# Altium project pokey.PrjPcb
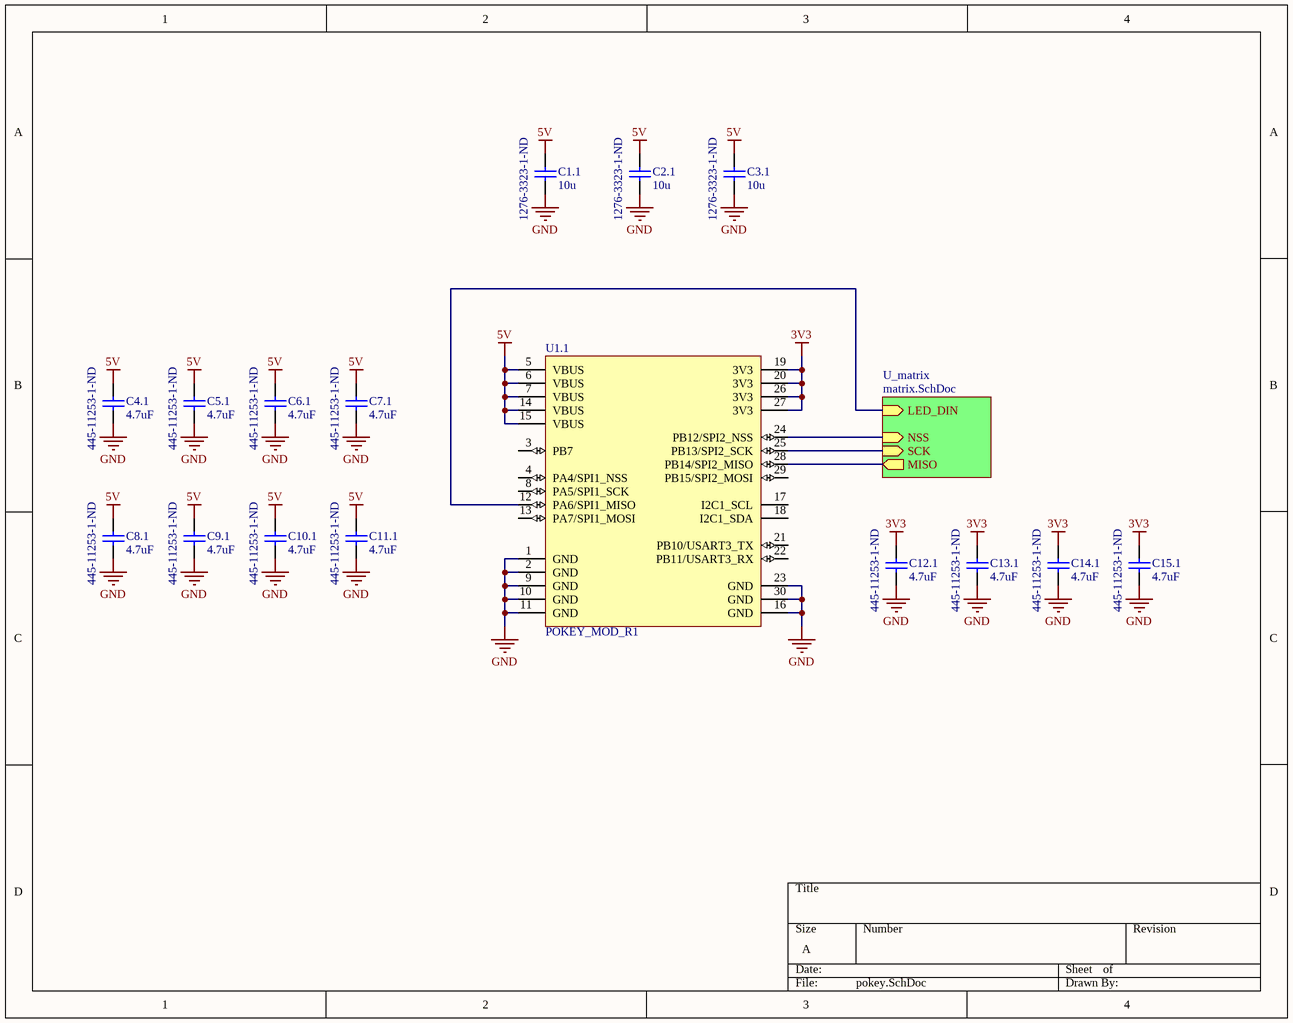
[diagram p0: pokey.SchDoc]
Assembly_Version: 01; PCB_Version: 1.0
3 sheets, 385 parts. Net scope: hierarchical (ports join the sheet entries above them; power ports are global).
Board file: pokey.PcbDoc
Sheets:
  pokey.SchDoc
    U_matrix = matrix.SchDoc
      U1 = key.SchDoc
      U1 = key.SchDoc
      U1 = key.SchDoc
      U1 = key.SchDoc
      U1 = key.SchDoc
      U1 = key.SchDoc
      U1 = key.SchDoc
      U1 = key.SchDoc
      U1 = key.SchDoc
      U1 = key.SchDoc
      U1 = key.SchDoc
      U1 = key.SchDoc
      U1 = key.SchDoc
      U1 = key.SchDoc
      U1 = key.SchDoc
      U1 = key.SchDoc
      U1 = key.SchDoc
      U1 = key.SchDoc
      U1 = key.SchDoc
      U1 = key.SchDoc
      U1 = key.SchDoc
      U1 = key.SchDoc
      U1 = key.SchDoc
      U1 = key.SchDoc
      U1 = key.SchDoc
      U1 = key.SchDoc
      U1 = key.SchDoc
      U1 = key.SchDoc
      U1 = key.SchDoc
      U1 = key.SchDoc
      U1 = key.SchDoc
      U1 = key.SchDoc
      U1 = key.SchDoc
      U1 = key.SchDoc
      U1 = key.SchDoc
      U1 = key.SchDoc
      U1 = key.SchDoc
      U1 = key.SchDoc
      U1 = key.SchDoc
      U1 = key.SchDoc
      U1 = key.SchDoc
      U1 = key.SchDoc
      U1 = key.SchDoc
      U1 = key.SchDoc
      U1 = key.SchDoc
      U1 = key.SchDoc
      U1 = key.SchDoc
      U1 = key.SchDoc
      U1 = key.SchDoc
      U1 = key.SchDoc
      U1 = key.SchDoc
      U1 = key.SchDoc
      U1 = key.SchDoc
      U1 = key.SchDoc
      U1 = key.SchDoc
      U1 = key.SchDoc
      U1 = key.SchDoc
      U1 = key.SchDoc
      U1 = key.SchDoc
      U1 = key.SchDoc
      U1 = key.SchDoc
      U1 = key.SchDoc
      U1 = key.SchDoc
      U1 = key.SchDoc
      U1 = key.SchDoc
      U1 = key.SchDoc
      U1 = key.SchDoc
      U1 = key.SchDoc
      U1 = key.SchDoc
      U1 = key.SchDoc
      U1 = key.SchDoc
      U1 = key.SchDoc
      U1 = key.SchDoc
      U1 = key.SchDoc
      U1 = key.SchDoc
      U1 = key.SchDoc
      U1 = key.SchDoc
      U1 = key.SchDoc
      U1 = key.SchDoc
      U1 = key.SchDoc
      U1 = key.SchDoc
      U1 = key.SchDoc
      U1 = key.SchDoc
      U1 = key.SchDoc
      U1 = key.SchDoc

## Sheet pokey.SchDoc
size A

### Parts
C1.1  Supplier Part Number 1: 1276-3323-1-ND  [1210]  (hidden comment: 10u)
C2.1  Supplier Part Number 1: 1276-3323-1-ND  [1210]  (hidden comment: 10u)
C3.1  Supplier Part Number 1: 1276-3323-1-ND  [1210]  (hidden comment: 10u)
C4.1  4.7uF  Supplier Part Number 1: 445-11253-1-ND  [1608[0603]]
C5.1  4.7uF  Supplier Part Number 1: 445-11253-1-ND  [1608[0603]]
C6.1  4.7uF  Supplier Part Number 1: 445-11253-1-ND  [1608[0603]]
C7.1  4.7uF  Supplier Part Number 1: 445-11253-1-ND  [1608[0603]]
C8.1  4.7uF  Supplier Part Number 1: 445-11253-1-ND  [1608[0603]]
C9.1  4.7uF  Supplier Part Number 1: 445-11253-1-ND  [1608[0603]]
C10.1  4.7uF  Supplier Part Number 1: 445-11253-1-ND  [1608[0603]]
C11.1  4.7uF  Supplier Part Number 1: 445-11253-1-ND  [1608[0603]]
C12.1  4.7uF  Supplier Part Number 1: 445-11253-1-ND  [1608[0603]]
C13.1  4.7uF  Supplier Part Number 1: 445-11253-1-ND  [1608[0603]]
C14.1  4.7uF  Supplier Part Number 1: 445-11253-1-ND  [1608[0603]]
C15.1  4.7uF  Supplier Part Number 1: 445-11253-1-ND  [1608[0603]]
U1.1  POKEY_MOD_R1  [POKEY_MOD_R1]

### Sub-sheets
U_matrix = matrix.SchDoc: LED_DIN (in), SCK (in), MISO (out), NSS (in)

### Nets
3V3: C12.1.2 C13.1.2 C14.1.2 C15.1.2 U1.1.19(3V3) U1.1.20(3V3) U1.1.26(3V3) U1.1.27(3V3)
5V: C1.1.2 C2.1.2 C3.1.2 C4.1.2 C5.1.2 C6.1.2 C7.1.2 C8.1.2 C9.1.2 C10.1.2 C11.1.2 U1.1.5(VBUS) U1.1.6(VBUS) U1.1.7(VBUS) U1.1.14(VBUS) U1.1.15(VBUS)
GND: C1.1.1 C2.1.1 C3.1.1 C4.1.1 C5.1.1 C6.1.1 C7.1.1 C8.1.1 C9.1.1 C10.1.1 C11.1.1 C12.1.1 C13.1.1 C14.1.1 C15.1.1 U1.1.1(GND) U1.1.2(GND) U1.1.9(GND) U1.1.10(GND) U1.1.11(GND) U1.1.16(GND) U1.1.23(GND) U1.1.30(GND)
NetQ1.2_3: U1.1.12(PA6/SPI1_MISO) ; sheet U_matrix/LED_DIN
NetU1.1_24: U1.1.24(PB12/SPI2_NSS) ; sheet U_matrix/NSS
NetU1.1_25: U1.1.25(PB13/SPI2_SCK) ; sheet U_matrix/SCK
NetU1.1_28: U1.1.28(PB14/SPI2_MISO) ; sheet U_matrix/MISO

Not connected (* = marked no-connect by the designer): U1.1 3(PB7) 4(PA4/SPI1_NSS) 8(PA5/SPI1_SCK) 13(PA7/SPI1_MOSI) 17(I2C1_SCL) 18(I2C1_SDA) 21(PB10/USART3_TX) 22(PB11/USART3_RX) 29(PB15/SPI2_MOSI)

### Library data of the parts
C1.1 C2.1 C3.1 = CAPACITOR NON_POL: Material: Ceramic; Capacitance: 10uF; Tolerance: 10%; Dielectric: X7R; Voltage Rating: 35V; Value: 10u; ComponentLink1URL: http://www.murata.com/~/media/webrenewal/support/library/catalog/products/capacitor/mlcc/c02e.ashx; ComponentLink1Description: http://www.murata.com/~/media/webrenewal/support/library/catalog/products/capacitor/mlcc/c02e.ashx; Supplier 1: Digi-Key; Stock 1: 421732; Pricing 1: 1 = 0.81000, 10 = 0.57000, 100 = 0.37510, 500 = 0.27788, 1000 = 0.23619 (USD); RoHS: Yes; Mount: Surface Mount; Case/Package: 1210; Case Code (Metric): 3225; Case Code (Imperial): 1210; Min Operating Temperature: -55°C; Max Operating Temperature: 125°C; Package Quantity: 1; Packaging: Tape and Reel; Voltage: 35V; Length: 3.2mm; Height: 1.8mm; Depth: 2.5mm; Width: 0.098inch; Thickness: 0.079inch; Radiation Hardening: No; Lead Free: Lead Free; ComponentLink2URL: https://datasheet.ciiva.com/25724/cl32b106klulnne-25724000.pdf?src-supplier=Digi-Key; ComponentLink2Description: https://datasheet.ciiva.com/25724/cl32b106klulnne-25724000.pdf?src-supplier=Digi-Key; ComponentLink3URL: https://datasheet.ciiva.com/15196/getdatasheetpartid-353216-15196149.pdf?src-supplier=Verical; ComponentLink3Description: https://datasheet.ciiva.com/15196/getdatasheetpartid-353216-15196149.pdf?src-supplier=Verical; ComponentLink4URL: https://datasheet.ciiva.com/29202/450840-da-01-en-vs-kondensator-1210-29202828.pdf?src-supplier=Conrad; ComponentLink4Description: https://datasheet.ciiva.com/29202/450840-da-01-en-vs-kondensator-1210-29202828.pdf?src-supplier=Conrad
C4.1 C5.1 C6.1 C7.1 C8.1 C9.1 C10.1 C11.1 C12.1 C13.1 C14.1 C15.1 = C0402: Value: 4.7uF; Supplier 1: Digi-Key

## Sheet matrix.SchDoc
size 1270 x 241 mm
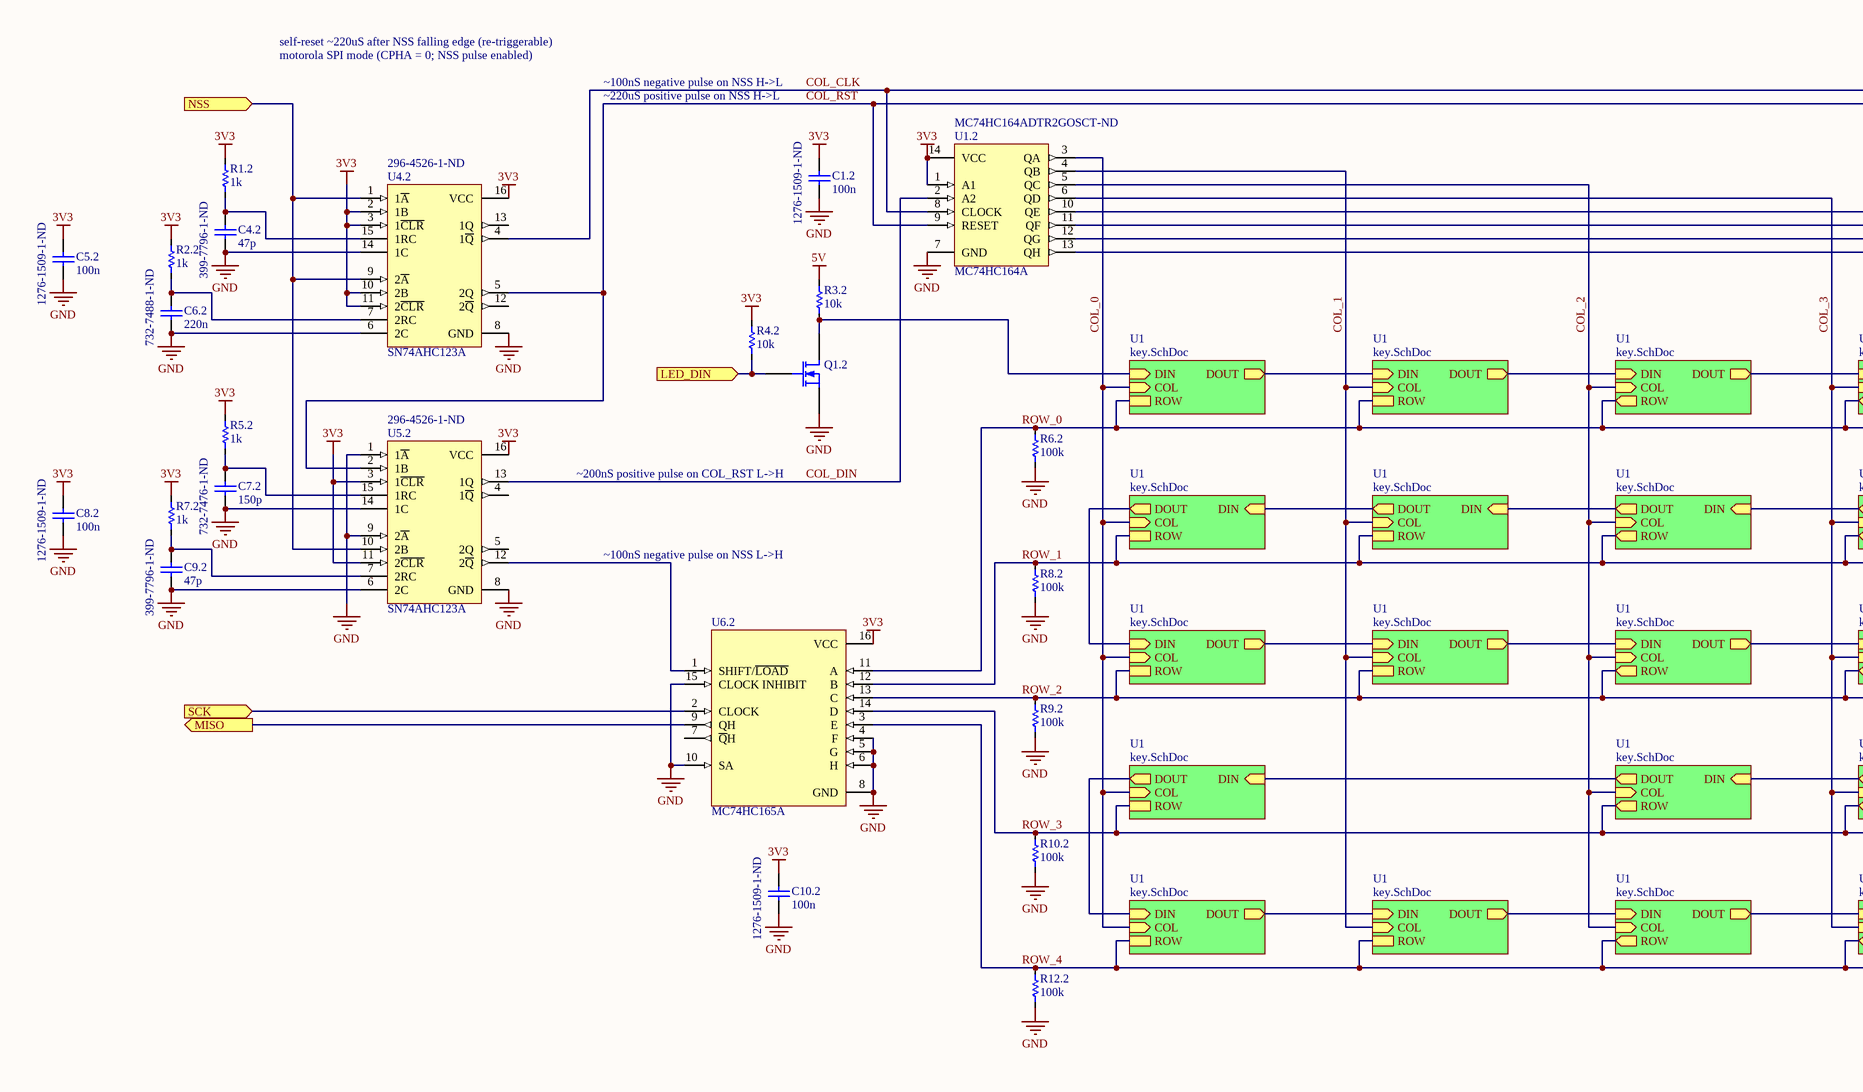
[diagram p1: matrix.SchDoc, left]
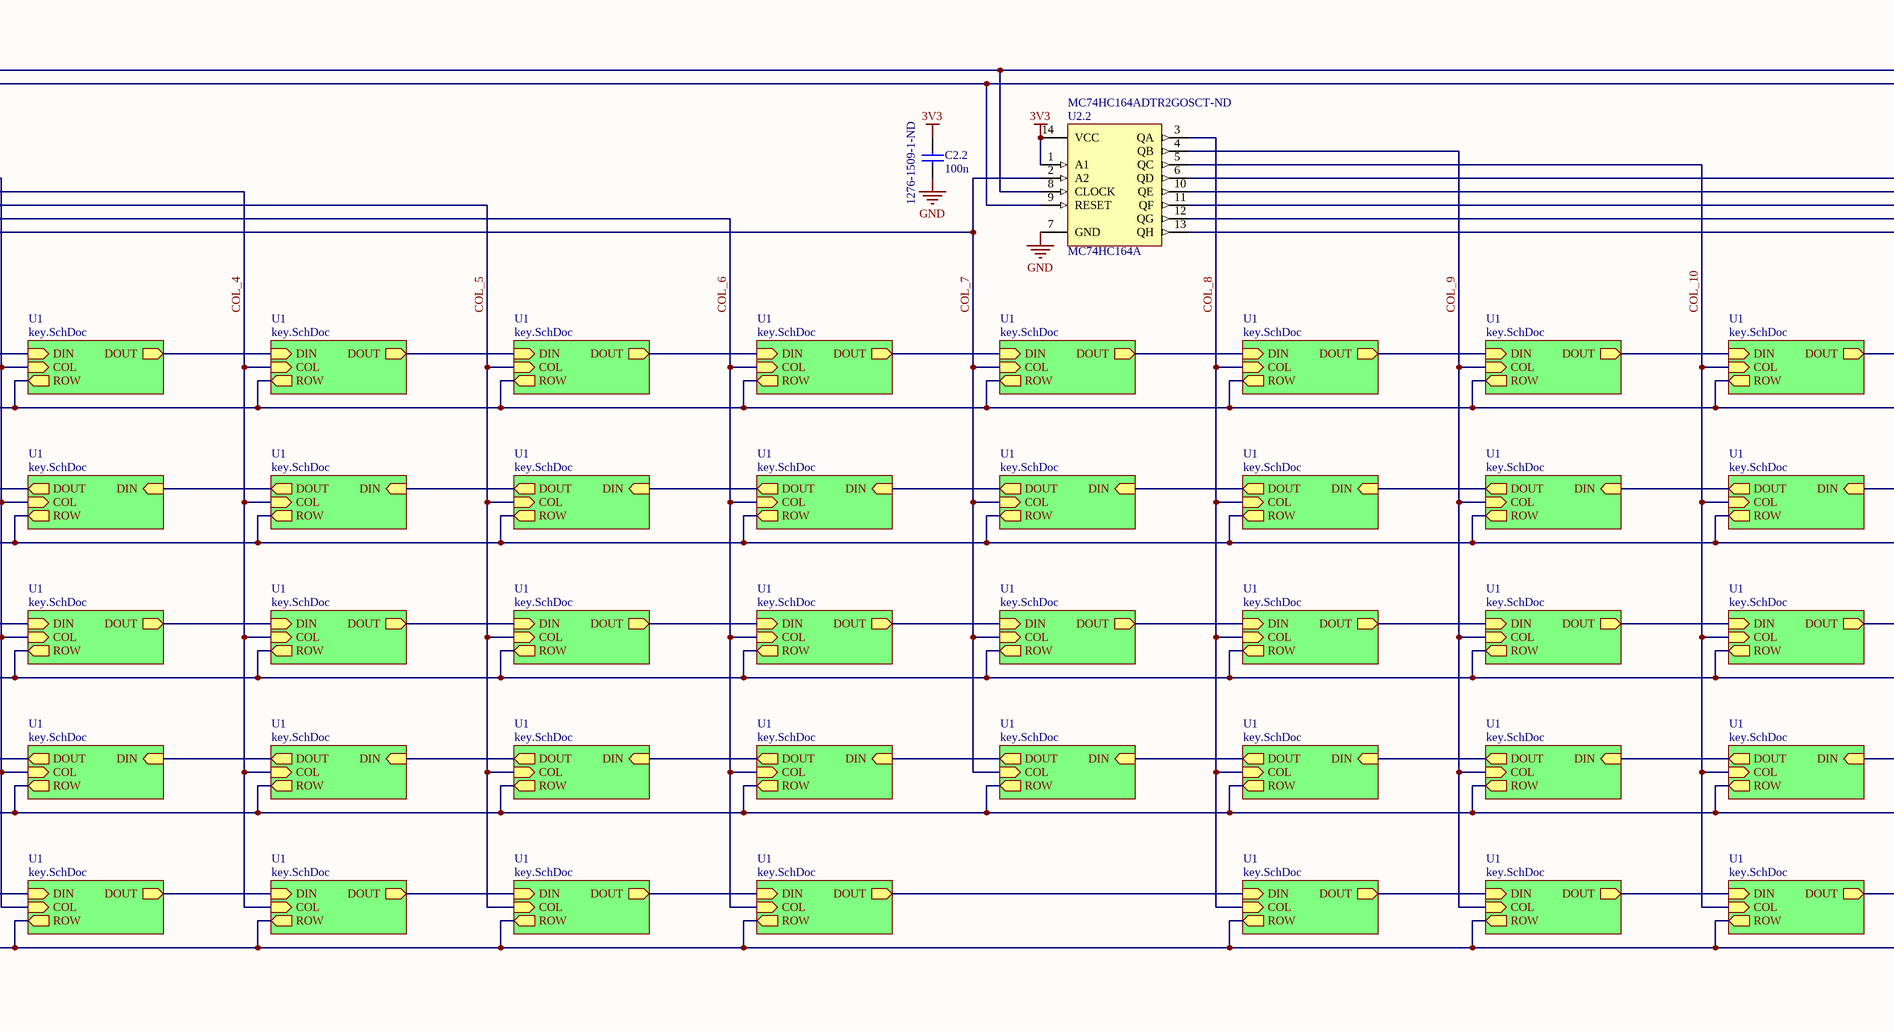
[diagram p2: matrix.SchDoc, middle]
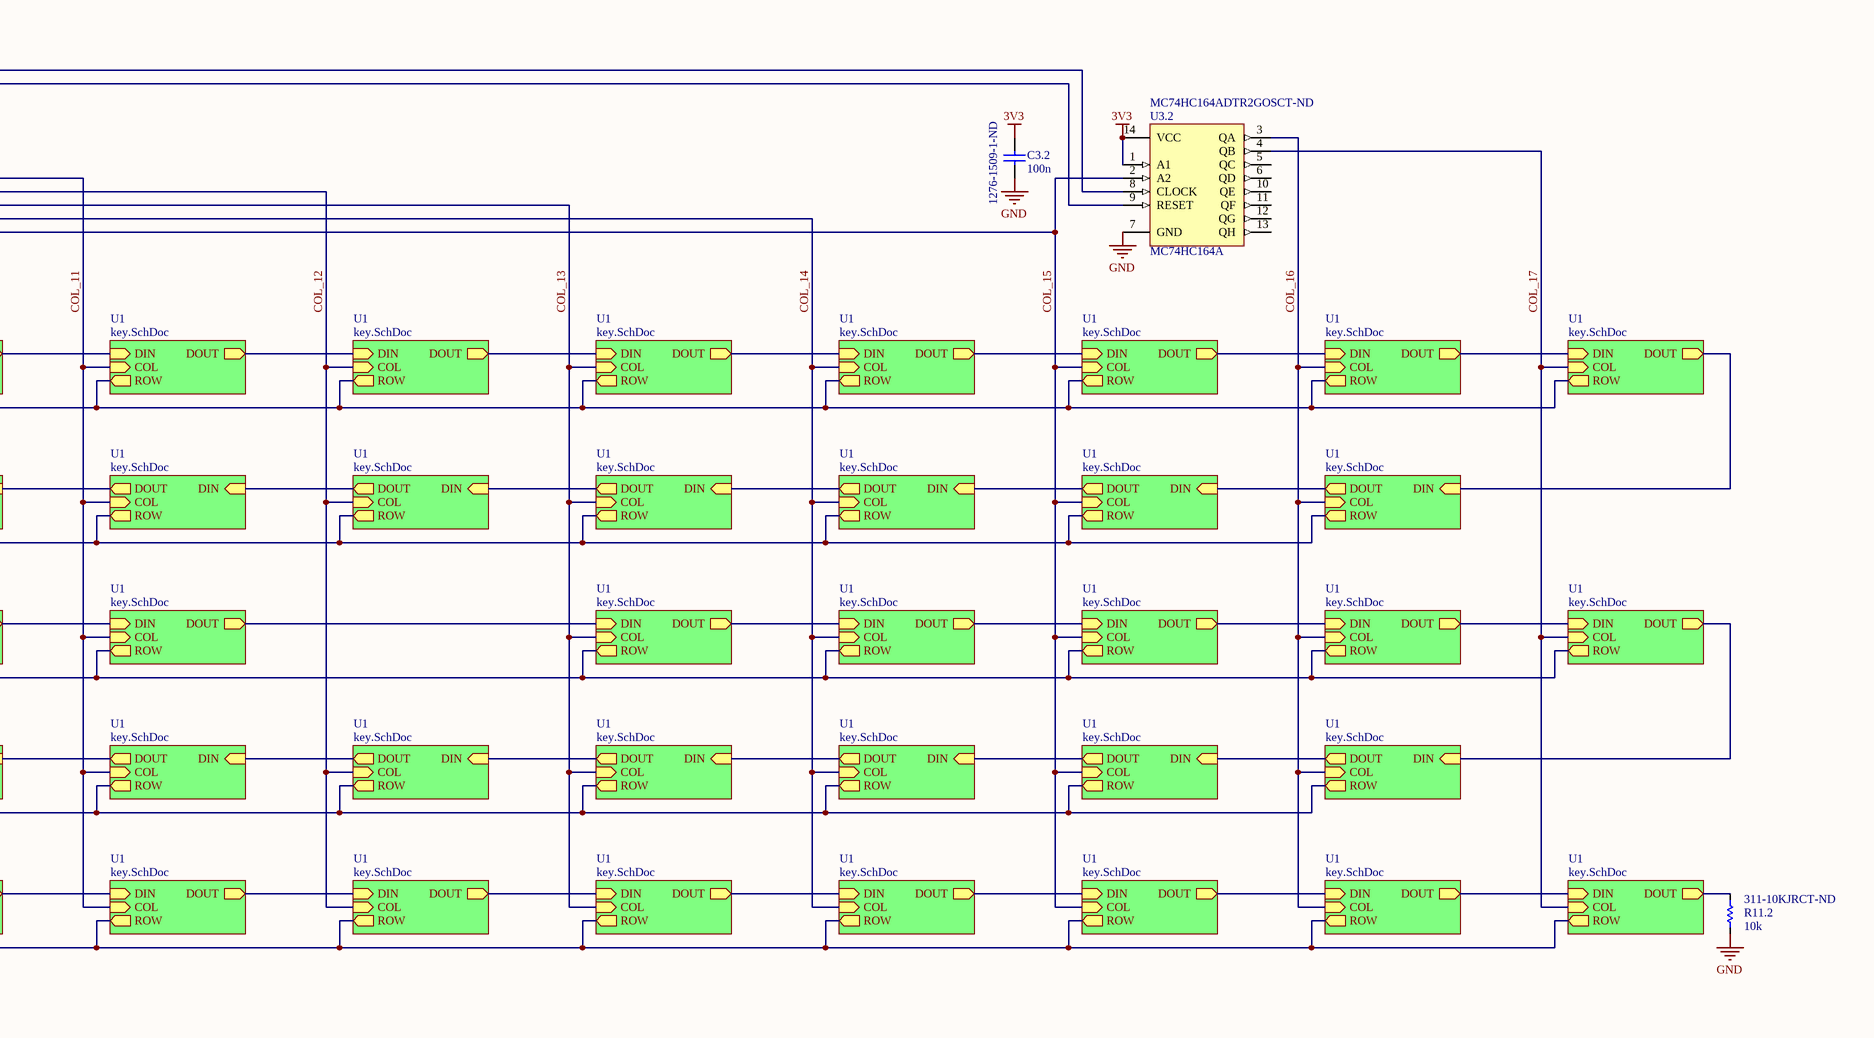
[diagram p3: matrix.SchDoc, right]

### Parts
C1.2  Supplier Part Number 1: 1276-1509-1-ND  [0402]  (hidden comment: 100n)
C2.2  Supplier Part Number 1: 1276-1509-1-ND  [0402]  (hidden comment: 100n)
C3.2  Supplier Part Number 1: 1276-1509-1-ND  [0402]  (hidden comment: 100n)
C4.2  Supplier Part Number 1: 399-7796-1-ND  [0402]  (hidden comment: 47p)
C5.2  Supplier Part Number 1: 1276-1509-1-ND  [0402]  (hidden comment: 100n)
C6.2  Supplier Part Number 1: 732-7488-1-ND  [0402]  (hidden comment: 220n)
C7.2  Supplier Part Number 1: 732-7476-1-ND  [0402]  (hidden comment: 150p)
C8.2  Supplier Part Number 1: 1276-1509-1-ND  [0402]  (hidden comment: 100n)
C9.2  Supplier Part Number 1: 399-7796-1-ND  [0402]  (hidden comment: 47p)
C10.2  Supplier Part Number 1: 1276-1509-1-ND  [0402]  (hidden comment: 100n)
Q1.2  2N7002  [SOT23]  (value not drawn)
R1.2  1k  [0402]
R2.2  1k  [0402]
R3.2  10k  [0402]
R4.2  10k  [0402]
R5.2  1k  [0402]
R6.2  100k  [0402]
R7.2  1k  [0402]
R8.2  100k  [0402]
R9.2  100k  [0402]
R10.2  100k  [0402]
R11.2  Supplier Part Number 1: 311-10KJRCT-ND  [0402]  (hidden comment: 10k)
R12.2  100k  [0402]
U1.2  MC74HC164A  Supplier Part Number 1: MC74HC164ADTR2GOSCT-ND  [TSOP65P640X120-14N]
U2.2  MC74HC164A  Supplier Part Number 1: MC74HC164ADTR2GOSCT-ND  [TSOP65P640X120-14N]
U3.2  MC74HC164A  Supplier Part Number 1: MC74HC164ADTR2GOSCT-ND  [TSOP65P640X120-14N]
U4.2  SN74AHC123A  Supplier Part Number 1: 296-4526-1-ND  [TSSOP16_N]
U5.2  SN74AHC123A  Supplier Part Number 1: 296-4526-1-ND  [TSSOP16_N]
U6.2  MC74HC165A  [TSSOP16_N]

### Sub-sheets
U1 = key.SchDoc: COL (in), ROW, DOUT (out), DIN (in)
U1 = key.SchDoc: COL (in), ROW, DOUT (out), DIN (in)
U1 = key.SchDoc: COL (in), ROW (out), DOUT (out), DIN (in)
U1 = key.SchDoc: COL (in), ROW (out), DOUT (out), DIN (in)
U1 = key.SchDoc: COL (in), ROW (out), DOUT (out), DIN (in)
U1 = key.SchDoc: COL (in), ROW (out), DOUT (out), DIN (in)
U1 = key.SchDoc: COL (in), ROW (out), DOUT (out), DIN (in)
U1 = key.SchDoc: COL (in), ROW (out), DOUT (out), DIN (in)
U1 = key.SchDoc: COL (in), ROW (out), DOUT (out), DIN (in)
U1 = key.SchDoc: COL (in), ROW (out), DOUT (out), DIN (in)
U1 = key.SchDoc: COL (in), ROW (out), DOUT (out), DIN (in)
U1 = key.SchDoc: COL (in), ROW (out), DOUT (out), DIN (in)
U1 = key.SchDoc: COL (in), ROW (out), DOUT (out), DIN (in)
U1 = key.SchDoc: COL (in), ROW (out), DOUT (out), DIN (in)
U1 = key.SchDoc: COL (in), ROW (out), DOUT (out), DIN (in)
U1 = key.SchDoc: COL (in), ROW (out), DOUT (out), DIN (in)
U1 = key.SchDoc: COL (in), ROW (out), DOUT (out), DIN (in)
U1 = key.SchDoc: COL (in), ROW (out), DOUT (out), DIN (in)
U1 = key.SchDoc: COL (in), ROW, DOUT (out), DIN (in)
U1 = key.SchDoc: COL (in), ROW, DOUT (out), DIN (in)
U1 = key.SchDoc: COL (in), ROW (out), DOUT (out), DIN (in)
U1 = key.SchDoc: COL (in), ROW (out), DOUT (out), DIN (in)
U1 = key.SchDoc: COL (in), ROW (out), DOUT (out), DIN (in)
U1 = key.SchDoc: COL (in), ROW (out), DOUT (out), DIN (in)
U1 = key.SchDoc: COL (in), ROW (out), DOUT (out), DIN (in)
U1 = key.SchDoc: COL (in), ROW (out), DOUT (out), DIN (in)
U1 = key.SchDoc: COL (in), ROW (out), DOUT (out), DIN (in)
U1 = key.SchDoc: COL (in), ROW (out), DOUT (out), DIN (in)
U1 = key.SchDoc: COL (in), ROW (out), DOUT (out), DIN (in)
U1 = key.SchDoc: COL (in), ROW (out), DOUT (out), DIN (in)
U1 = key.SchDoc: COL (in), ROW (out), DOUT (out), DIN (in)
U1 = key.SchDoc: COL (in), ROW (out), DOUT (out), DIN (in)
U1 = key.SchDoc: COL (in), ROW, DOUT (out), DIN (in)
U1 = key.SchDoc: COL (in), ROW, DOUT (out), DIN (in)
U1 = key.SchDoc: COL (in), ROW (out), DOUT (out), DIN (in)
U1 = key.SchDoc: COL (in), ROW (out), DOUT (out), DIN (in)
U1 = key.SchDoc: COL (in), ROW (out), DOUT (out), DIN (in)
U1 = key.SchDoc: COL (in), ROW (out), DOUT (out), DIN (in)
U1 = key.SchDoc: COL (in), ROW (out), DOUT (out), DIN (in)
U1 = key.SchDoc: COL (in), ROW (out), DOUT (out), DIN (in)
U1 = key.SchDoc: COL (in), ROW (out), DOUT (out), DIN (in)
U1 = key.SchDoc: COL (in), ROW (out), DOUT (out), DIN (in)
U1 = key.SchDoc: COL (in), ROW (out), DOUT (out), DIN (in)
U1 = key.SchDoc: COL (in), ROW (out), DOUT (out), DIN (in)
U1 = key.SchDoc: COL (in), ROW (out), DOUT (out), DIN (in)
U1 = key.SchDoc: COL (in), ROW, DOUT (out), DIN (in)
U1 = key.SchDoc: COL (in), ROW (out), DOUT (out), DIN (in)
U1 = key.SchDoc: COL (in), ROW (out), DOUT (out), DIN (in)
U1 = key.SchDoc: COL (in), ROW (out), DOUT (out), DIN (in)
U1 = key.SchDoc: COL (in), ROW (out), DOUT (out), DIN (in)
U1 = key.SchDoc: COL (in), ROW (out), DOUT (out), DIN (in)
U1 = key.SchDoc: COL (in), ROW (out), DOUT (out), DIN (in)
U1 = key.SchDoc: COL (in), ROW (out), DOUT (out), DIN (in)
U1 = key.SchDoc: COL (in), ROW (out), DOUT (out), DIN (in)
U1 = key.SchDoc: COL (in), ROW (out), DOUT (out), DIN (in)
U1 = key.SchDoc: COL (in), ROW (out), DOUT (out), DIN (in)
U1 = key.SchDoc: COL (in), ROW (out), DOUT (out), DIN (in)
U1 = key.SchDoc: COL (in), ROW, DOUT (out), DIN (in)
U1 = key.SchDoc: COL (in), ROW, DOUT (out), DIN (in)
U1 = key.SchDoc: COL (in), ROW (out), DOUT (out), DIN (in)
U1 = key.SchDoc: COL (in), ROW (out), DOUT (out), DIN (in)
U1 = key.SchDoc: COL (in), ROW (out), DOUT (out), DIN (in)
U1 = key.SchDoc: COL (in), ROW (out), DOUT (out), DIN (in)
U1 = key.SchDoc: COL (in), ROW (out), DOUT (out), DIN (in)
U1 = key.SchDoc: COL (in), ROW (out), DOUT (out), DIN (in)
U1 = key.SchDoc: COL (in), ROW (out), DOUT (out), DIN (in)
U1 = key.SchDoc: COL (in), ROW (out), DOUT (out), DIN (in)
U1 = key.SchDoc: COL (in), ROW (out), DOUT (out), DIN (in)
U1 = key.SchDoc: COL (in), ROW (out), DOUT (out), DIN (in)
U1 = key.SchDoc: COL (in), ROW (out), DOUT (out), DIN (in)
U1 = key.SchDoc: COL (in), ROW (out), DOUT (out), DIN (in)
U1 = key.SchDoc: COL (in), ROW (out), DOUT (out), DIN (in)
U1 = key.SchDoc: COL (in), ROW (out), DOUT (out), DIN (in)
U1 = key.SchDoc: COL (in), ROW (out), DOUT (out), DIN (in)
U1 = key.SchDoc: COL (in), ROW (out), DOUT (out), DIN (in)
U1 = key.SchDoc: COL (in), ROW (out), DOUT (out), DIN (in)
U1 = key.SchDoc: COL (in), ROW (out), DOUT (out), DIN (in)
U1 = key.SchDoc: COL (in), ROW (out), DOUT (out), DIN (in)
U1 = key.SchDoc: COL (in), ROW (out), DOUT (out), DIN (in)
U1 = key.SchDoc: COL (in), ROW (out), DOUT (out), DIN (in)
U1 = key.SchDoc: COL (in), ROW (out), DOUT (out), DIN (in)
U1 = key.SchDoc: COL (in), ROW (out), DOUT (out), DIN (in)
U1 = key.SchDoc: COL (in), ROW (out), DOUT (out), DIN (in)
U1 = key.SchDoc: COL (in), ROW (out), DOUT (out), DIN (in)
U1 = key.SchDoc: COL (in), ROW (out), DOUT (out), DIN (in)

### Ports
LED_DIN (in), MISO (out), NSS (in), SCK (in)

### Nets
3V3: C1.2.1 C2.2.1 C3.2.1 C5.2.1 C8.2.1 C10.2.1 R1.2.2 R2.2.2 R4.2.2 R5.2.2 R7.2.2 U1.2.1(A1) U1.2.14(VCC) U2.2.1(A1) U2.2.14(VCC) U3.2.1(A1) U3.2.14(VCC) U4.2.2(1B) U4.2.3(1~{CLR}) U4.2.10(2B) U4.2.11(2~{CLR}) U4.2.16(VCC) U5.2.3(1~{CLR}) U5.2.11(2~{CLR}) U5.2.16(VCC) U6.2.16(VCC)
5V: R3.2.2
GND: C1.2.2 C2.2.2 C3.2.2 C4.2.1 C5.2.2 C6.2.2 C7.2.1 C8.2.2 C9.2.1 C10.2.2 Q1.2.2(S) R6.2.1 R8.2.1 R9.2.1 R10.2.1 R11.2.1 R12.2.1 U1.2.7(GND) U2.2.7(GND) U3.2.7(GND) U4.2.6(2C) U4.2.8(GND) U4.2.14(1C) U5.2.1(1~{A}) U5.2.6(2C) U5.2.8(GND) U5.2.9(2~{A}) U5.2.14(1C) U6.2.4(F) U6.2.5(G) U6.2.6(H) U6.2.8(GND) U6.2.10(SA) U6.2.15(CLOCK_INHIBIT)
COL_0: U1.2.3(QA) ; sheet U1/COL, sheet U1/COL, sheet U1/COL, sheet U1/COL, sheet U1/COL
COL_1: U1.2.4(QB) ; sheet U1/COL, sheet U1/COL, sheet U1/COL, sheet U1/COL
COL_2: U1.2.5(QC) ; sheet U1/COL, sheet U1/COL, sheet U1/COL, sheet U1/COL, sheet U1/COL
COL_3: U1.2.6(QD) ; sheet U1/COL, sheet U1/COL, sheet U1/COL, sheet U1/COL, sheet U1/COL
COL_4: U1.2.10(QE) ; sheet U1/COL, sheet U1/COL, sheet U1/COL, sheet U1/COL, sheet U1/COL
COL_5: U1.2.11(QF) ; sheet U1/COL, sheet U1/COL, sheet U1/COL, sheet U1/COL, sheet U1/COL
COL_6: U1.2.12(QG) ; sheet U1/COL, sheet U1/COL, sheet U1/COL, sheet U1/COL, sheet U1/COL
COL_7: U1.2.13(QH) U2.2.2(A2) ; sheet U1/COL, sheet U1/COL, sheet U1/COL, sheet U1/COL
COL_8: U2.2.3(QA) ; sheet U1/COL, sheet U1/COL, sheet U1/COL, sheet U1/COL, sheet U1/COL
COL_9: U2.2.4(QB) ; sheet U1/COL, sheet U1/COL, sheet U1/COL, sheet U1/COL, sheet U1/COL
COL_10: U2.2.5(QC) ; sheet U1/COL, sheet U1/COL, sheet U1/COL, sheet U1/COL, sheet U1/COL
COL_11: U2.2.6(QD) ; sheet U1/COL, sheet U1/COL, sheet U1/COL, sheet U1/COL, sheet U1/COL
COL_12: U2.2.10(QE) ; sheet U1/COL, sheet U1/COL, sheet U1/COL, sheet U1/COL
COL_13: U2.2.11(QF) ; sheet U1/COL, sheet U1/COL, sheet U1/COL, sheet U1/COL, sheet U1/COL
COL_14: U2.2.12(QG) ; sheet U1/COL, sheet U1/COL, sheet U1/COL, sheet U1/COL, sheet U1/COL
COL_15: U2.2.13(QH) U3.2.2(A2) ; sheet U1/COL, sheet U1/COL, sheet U1/COL, sheet U1/COL, sheet U1/COL
COL_16: U3.2.3(QA) ; sheet U1/COL, sheet U1/COL, sheet U1/COL, sheet U1/COL, sheet U1/COL
COL_17: U3.2.4(QB) ; sheet U1/COL, sheet U1/COL, sheet U1/COL
COL_CLK: U1.2.8(CLOCK) U2.2.8(CLOCK) U3.2.8(CLOCK) U4.2.4(1~{Q})
COL_DIN: U1.2.2(A2) U5.2.13(1Q)
COL_RST: U1.2.9(RESET) U2.2.9(RESET) U3.2.9(RESET) U4.2.5(2Q) U5.2.2(1B)
ROW_0: R6.2.2 U6.2.11(A) ; sheet U1/ROW, sheet U1/ROW, sheet U1/ROW, sheet U1/ROW, sheet U1/ROW, sheet U1/ROW, sheet U1/ROW, sheet U1/ROW, sheet U1/ROW, sheet U1/ROW, sheet U1/ROW, sheet U1/ROW, sheet U1/ROW, sheet U1/ROW, sheet U1/ROW, sheet U1/ROW, sheet U1/ROW, sheet U1/ROW
ROW_1: R8.2.2 U6.2.12(B) ; sheet U1/ROW, sheet U1/ROW, sheet U1/ROW, sheet U1/ROW, sheet U1/ROW, sheet U1/ROW, sheet U1/ROW, sheet U1/ROW, sheet U1/ROW, sheet U1/ROW, sheet U1/ROW, sheet U1/ROW, sheet U1/ROW, sheet U1/ROW, sheet U1/ROW, sheet U1/ROW, sheet U1/ROW
ROW_2: R9.2.2 U6.2.13(C) ; sheet U1/ROW, sheet U1/ROW, sheet U1/ROW, sheet U1/ROW, sheet U1/ROW, sheet U1/ROW, sheet U1/ROW, sheet U1/ROW, sheet U1/ROW, sheet U1/ROW, sheet U1/ROW, sheet U1/ROW, sheet U1/ROW, sheet U1/ROW, sheet U1/ROW, sheet U1/ROW, sheet U1/ROW
ROW_3: R10.2.2 U6.2.14(D) ; sheet U1/ROW, sheet U1/ROW, sheet U1/ROW, sheet U1/ROW, sheet U1/ROW, sheet U1/ROW, sheet U1/ROW, sheet U1/ROW, sheet U1/ROW, sheet U1/ROW, sheet U1/ROW, sheet U1/ROW, sheet U1/ROW, sheet U1/ROW, sheet U1/ROW, sheet U1/ROW
ROW_4: R12.2.2 U6.2.3(E) ; sheet U1/ROW, sheet U1/ROW, sheet U1/ROW, sheet U1/ROW, sheet U1/ROW, sheet U1/ROW, sheet U1/ROW, sheet U1/ROW, sheet U1/ROW, sheet U1/ROW, sheet U1/ROW, sheet U1/ROW, sheet U1/ROW, sheet U1/ROW, sheet U1/ROW, sheet U1/ROW, sheet U1/ROW
NetC4.2_2: C4.2.2 R1.2.1 U4.2.15(1RC)
NetC6.2_1: C6.2.1 R2.2.1 U4.2.7(2RC)
NetC7.2_2: C7.2.2 R5.2.1 U5.2.15(1RC)
NetC9.2_2: C9.2.2 R7.2.1 U5.2.7(2RC)
NetD1.3.1_2: sheet U1/DOUT, sheet U1/DIN
NetD1.3.1_4: Q1.2.1(D) R3.2.1 ; sheet U1/DIN
NetD1.3.2_2: sheet U1/DOUT, sheet U1/DIN
NetD1.3.3_2: sheet U1/DOUT, sheet U1/DIN
NetD1.3.4_2: sheet U1/DOUT, sheet U1/DIN
NetD1.3.5_2: sheet U1/DOUT, sheet U1/DIN
NetD1.3.6_2: sheet U1/DOUT, sheet U1/DIN
NetD1.3.7_2: sheet U1/DOUT, sheet U1/DIN
NetD1.3.8_2: sheet U1/DOUT, sheet U1/DIN
NetD1.3.9_2: sheet U1/DOUT, sheet U1/DIN
NetD1.3.10_2: sheet U1/DOUT, sheet U1/DIN
NetD1.3.11_2: sheet U1/DOUT, sheet U1/DIN
NetD1.3.12_2: sheet U1/DOUT, sheet U1/DIN
NetD1.3.13_2: sheet U1/DOUT, sheet U1/DIN
NetD1.3.14_2: sheet U1/DOUT, sheet U1/DIN
NetD1.3.15_2: sheet U1/DOUT, sheet U1/DIN
NetD1.3.16_2: sheet U1/DOUT, sheet U1/DIN
NetD1.3.17_2: sheet U1/DOUT, sheet U1/DIN
NetD1.3.18_2: sheet U1/DOUT, sheet U1/DIN
NetD1.3.19_2: sheet U1/DOUT, sheet U1/DIN
NetD1.3.19_4: sheet U1/DIN, sheet U1/DOUT
NetD1.3.20_4: sheet U1/DIN, sheet U1/DOUT
NetD1.3.21_4: sheet U1/DIN, sheet U1/DOUT
NetD1.3.22_4: sheet U1/DIN, sheet U1/DOUT
NetD1.3.23_4: sheet U1/DIN, sheet U1/DOUT
NetD1.3.24_4: sheet U1/DIN, sheet U1/DOUT
NetD1.3.25_4: sheet U1/DIN, sheet U1/DOUT
NetD1.3.26_4: sheet U1/DIN, sheet U1/DOUT
NetD1.3.27_4: sheet U1/DIN, sheet U1/DOUT
NetD1.3.28_4: sheet U1/DIN, sheet U1/DOUT
NetD1.3.29_4: sheet U1/DIN, sheet U1/DOUT
NetD1.3.30_4: sheet U1/DIN, sheet U1/DOUT
NetD1.3.31_4: sheet U1/DIN, sheet U1/DOUT
NetD1.3.32_4: sheet U1/DIN, sheet U1/DOUT
NetD1.3.33_2: sheet U1/DOUT, sheet U1/DIN
NetD1.3.34_2: sheet U1/DOUT, sheet U1/DIN
NetD1.3.35_2: sheet U1/DOUT, sheet U1/DIN
NetD1.3.36_2: sheet U1/DOUT, sheet U1/DIN
NetD1.3.37_2: sheet U1/DOUT, sheet U1/DIN
NetD1.3.38_2: sheet U1/DOUT, sheet U1/DIN
NetD1.3.39_2: sheet U1/DOUT, sheet U1/DIN
NetD1.3.40_2: sheet U1/DOUT, sheet U1/DIN
NetD1.3.41_2: sheet U1/DOUT, sheet U1/DIN
NetD1.3.42_2: sheet U1/DOUT, sheet U1/DIN
NetD1.3.43_2: sheet U1/DOUT, sheet U1/DIN
NetD1.3.44_2: sheet U1/DOUT, sheet U1/DIN
NetD1.3.45_2: sheet U1/DOUT, sheet U1/DIN
NetD1.3.46_2: sheet U1/DOUT, sheet U1/DIN
NetD1.3.46_4: sheet U1/DIN, sheet U1/DOUT
NetD1.3.47_4: sheet U1/DIN, sheet U1/DOUT
NetD1.3.48_4: sheet U1/DIN, sheet U1/DOUT
NetD1.3.49_4: sheet U1/DIN, sheet U1/DOUT
NetD1.3.50_4: sheet U1/DIN, sheet U1/DOUT
NetD1.3.51_4: sheet U1/DIN, sheet U1/DOUT
NetD1.3.52_4: sheet U1/DIN, sheet U1/DOUT
NetD1.3.53_4: sheet U1/DIN, sheet U1/DOUT
NetD1.3.54_4: sheet U1/DIN, sheet U1/DOUT
NetD1.3.55_4: sheet U1/DIN, sheet U1/DOUT
NetD1.3.56_4: sheet U1/DIN, sheet U1/DOUT
NetD1.3.57_4: sheet U1/DIN, sheet U1/DOUT
NetD1.3.58_2: sheet U1/DOUT, sheet U1/DIN
NetD1.3.59_2: sheet U1/DOUT, sheet U1/DIN
NetD1.3.60_2: sheet U1/DOUT, sheet U1/DIN
NetD1.3.61_2: sheet U1/DOUT, sheet U1/DIN
NetD1.3.62_2: sheet U1/DOUT, sheet U1/DIN
NetD1.3.63_2: sheet U1/DOUT, sheet U1/DIN
NetD1.3.64_2: sheet U1/DOUT, sheet U1/DIN
NetD1.3.65_2: sheet U1/DOUT, sheet U1/DIN
NetD1.3.66_2: sheet U1/DOUT, sheet U1/DIN
NetD1.3.67_2: sheet U1/DOUT, sheet U1/DIN
NetD1.3.68_2: sheet U1/DOUT, sheet U1/DIN
NetD1.3.69_2: sheet U1/DOUT, sheet U1/DIN
NetD1.3.70_2: sheet U1/DOUT, sheet U1/DIN
NetD1.3.71_2: sheet U1/DOUT, sheet U1/DIN
NetD1.3.72_4: sheet U1/DIN, sheet U1/DOUT
NetD1.3.73_4: sheet U1/DIN, sheet U1/DOUT
NetD1.3.74_4: sheet U1/DIN, sheet U1/DOUT
NetD1.3.76_2: sheet U1/DOUT, sheet U1/DIN
NetD1.3.77_2: sheet U1/DOUT, sheet U1/DIN
NetD1.3.78_2: sheet U1/DOUT, sheet U1/DIN
NetD1.3.79_2: sheet U1/DOUT, sheet U1/DIN
NetD1.3.80_4: sheet U1/DIN, sheet U1/DOUT
NetD1.3.81_4: sheet U1/DIN, sheet U1/DOUT
NetD1.3.83_2: sheet U1/DOUT, sheet U1/DIN
NetD1.3.84_2: sheet U1/DOUT, sheet U1/DIN
NetD1.3.85_2: R11.2.2 ; sheet U1/DOUT
NetQ1.2_3: Q1.2.3(G) R4.2.1 ; port LED_DIN
NetU1.1_24: U4.2.1(1~{A}) U4.2.9(2~{A}) U5.2.10(2B) ; port NSS
NetU1.1_25: U6.2.2(CLOCK) ; port SCK
NetU1.1_28: U6.2.9(QH) ; port MISO
NetU5.2_12: U5.2.12(2~{Q}) U6.2.1(SHIFT/~{LOAD})

Not connected (* = marked no-connect by the designer): U3.2 5(QC) 6(QD) 10(QE) 11(QF) 12(QG) 13(QH); U4.2 12(2~{Q}) 13(1Q); U5.2 4(1~{Q}) 5(2Q); U6.2 7(~{Q}H)

### Notes on the sheet
- self-reset ~220uS after NSS falling edge (re-triggerable)
- motorola SPI mode (CPHA = 0; NSS pulse enabled)
- ~100nS negative pulse on NSS H->L
- ~220uS positive pulse on NSS H->L
- ~200nS positive pulse on COL_RST L->H
- ~100nS negative pulse on NSS L->H

### Library data of the parts
C1.2 C2.2 C3.2 C4.2 C5.2 C6.2 C7.2 C8.2 C9.2 C10.2 = CAPACITOR NON_POL: Supplier 1: Digi-Key
  C1.2 C2.2 C3.2 C5.2 C8.2 C10.2: Value: 100n
  C4.2 C9.2: Value: 47p
  C6.2: Value: 220n
  C7.2: Value: 150p
Q1.2 = 2N7002: N-Channel Enhancement Mode Vertical DMOS FET; Supplier 1: Digi-Key; Supplier Part Number 1: 2N7002-TPMSCT-ND
R1.2 R2.2 R3.2 R4.2 R5.2 R6.2 R7.2 R8.2 R9.2 R10.2 R11.2 R12.2 = RESISTOR: Supplier 1: Digi-Key
  R1.2 R2.2 R5.2 R7.2: Value: 1k; Supplier Part Number 1: A106129CT-ND
  R3.2 R4.2: Value: 10k; Supplier Part Number 1: 311-10KJRCT-ND
  R6.2 R8.2 R9.2 R10.2 R12.2: Value: 100k; Supplier Part Number 1: RMCF0402JT100KCT-ND
  R11.2: Value: 10k
U1.2 U2.2 U3.2 = MC74HC164A: IC SHIFT REGISTER 8BIT; Supplier 1: Digi-Key
U4.2 U5.2 = SN74AHC123A: IC DUAL RETRIG MULTIVIB; Supplier 1: Digi-Key
U6.2 = MC74HC165A: IC SHIFT REGISTER IN 8BIT

## Sheet key.SchDoc
size A
Used 85 times, as channels U_matrix/U1, U_matrix/U1, U_matrix/U1, U_matrix/U1, U_matrix/U1, U_matrix/U1, U_matrix/U1, U_matrix/U1, U_matrix/U1, U_matrix/U1, U_matrix/U1, U_matrix/U1, U_matrix/U1, U_matrix/U1, U_matrix/U1, U_matrix/U1, U_matrix/U1, U_matrix/U1, U_matrix/U1, U_matrix/U1, U_matrix/U1, U_matrix/U1, U_matrix/U1, U_matrix/U1, U_matrix/U1, U_matrix/U1, U_matrix/U1, U_matrix/U1, U_matrix/U1, U_matrix/U1, U_matrix/U1, U_matrix/U1, U_matrix/U1, U_matrix/U1, U_matrix/U1, U_matrix/U1, U_matrix/U1, U_matrix/U1, U_matrix/U1, U_matrix/U1, U_matrix/U1, U_matrix/U1, U_matrix/U1, U_matrix/U1, U_matrix/U1, U_matrix/U1, U_matrix/U1, U_matrix/U1, U_matrix/U1, U_matrix/U1, U_matrix/U1, U_matrix/U1, U_matrix/U1, U_matrix/U1, U_matrix/U1, U_matrix/U1, U_matrix/U1, U_matrix/U1, U_matrix/U1, U_matrix/U1, U_matrix/U1, U_matrix/U1, U_matrix/U1, U_matrix/U1, U_matrix/U1, U_matrix/U1, U_matrix/U1, U_matrix/U1, U_matrix/U1, U_matrix/U1, U_matrix/U1, U_matrix/U1, U_matrix/U1, U_matrix/U1, U_matrix/U1, U_matrix/U1, U_matrix/U1, U_matrix/U1, U_matrix/U1, U_matrix/U1, U_matrix/U1, U_matrix/U1, U_matrix/U1, U_matrix/U1, U_matrix/U1. Parts and nets are listed once, with the designators drawn on the sheet.
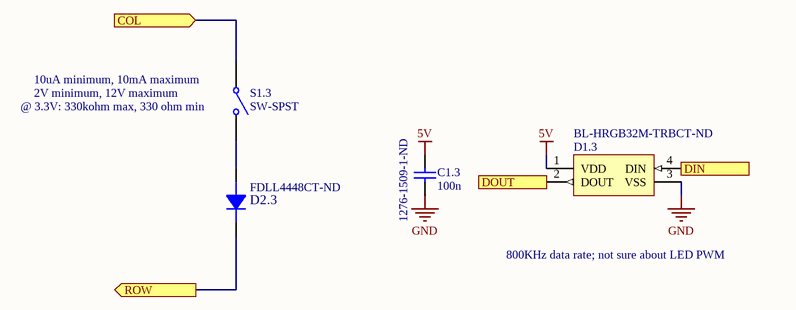
[diagram p4: key.SchDoc]

### Parts
C1.3  Supplier Part Number 1: 1276-1509-1-ND  [0402]  (hidden comment: 100n)
D1.3  Supplier Part Number 1: BL-HRGB32M-TRBCT-ND  [BL-HRGB32M-TRB]  (hidden comment: Addressable RGB LED)
D2.3  Supplier Part Number 1: FDLL4448CT-ND  [SOD-80]
S1.3  SW-SPST  [PG1350]

### Ports
COL (in), DIN (in), DOUT (out), ROW (out)

### Nets
5V: C1.3.1 D1.3.1(VDD)
GND: C1.3.2 D1.3.3(VSS)
COL: S1.3.1(COMMON) ; port COL
DIN: D1.3.4(DIN) ; port DIN
DOUT: D1.3.2(DOUT) ; port DOUT
ROW: D2.3.K ; port ROW
NetD2.3_A: D2.3.A S1.3.2(NO)

### Channels
U_matrix/U1: designators end in .1; ports COL=COL_0 DIN=NetD1.3.1_4 DOUT=NetD1.3.1_2 ROW=ROW_0
U_matrix/U1: designators end in .2; ports COL=COL_1 DIN=NetD1.3.1_2 DOUT=NetD1.3.2_2 ROW=ROW_0
U_matrix/U1: designators end in .3; ports COL=COL_2 DIN=NetD1.3.2_2 DOUT=NetD1.3.3_2 ROW=ROW_0
U_matrix/U1: designators end in .4; ports COL=COL_3 DIN=NetD1.3.3_2 DOUT=NetD1.3.4_2 ROW=ROW_0
U_matrix/U1: designators end in .5; ports COL=COL_4 DIN=NetD1.3.4_2 DOUT=NetD1.3.5_2 ROW=ROW_0
U_matrix/U1: designators end in .6; ports COL=COL_5 DIN=NetD1.3.5_2 DOUT=NetD1.3.6_2 ROW=ROW_0
U_matrix/U1: designators end in .7; ports COL=COL_6 DIN=NetD1.3.6_2 DOUT=NetD1.3.7_2 ROW=ROW_0
U_matrix/U1: designators end in .8; ports COL=COL_7 DIN=NetD1.3.7_2 DOUT=NetD1.3.8_2 ROW=ROW_0
U_matrix/U1: designators end in .9; ports COL=COL_8 DIN=NetD1.3.8_2 DOUT=NetD1.3.9_2 ROW=ROW_0
U_matrix/U1: designators end in .10; ports COL=COL_9 DIN=NetD1.3.9_2 DOUT=NetD1.3.10_2 ROW=ROW_0
U_matrix/U1: designators end in .11; ports COL=COL_10 DIN=NetD1.3.10_2 DOUT=NetD1.3.11_2 ROW=ROW_0
U_matrix/U1: designators end in .12; ports COL=COL_11 DIN=NetD1.3.11_2 DOUT=NetD1.3.12_2 ROW=ROW_0
U_matrix/U1: designators end in .13; ports COL=COL_12 DIN=NetD1.3.12_2 DOUT=NetD1.3.13_2 ROW=ROW_0
U_matrix/U1: designators end in .14; ports COL=COL_13 DIN=NetD1.3.13_2 DOUT=NetD1.3.14_2 ROW=ROW_0
U_matrix/U1: designators end in .15; ports COL=COL_14 DIN=NetD1.3.14_2 DOUT=NetD1.3.15_2 ROW=ROW_0
U_matrix/U1: designators end in .16; ports COL=COL_15 DIN=NetD1.3.15_2 DOUT=NetD1.3.16_2 ROW=ROW_0
U_matrix/U1: designators end in .17; ports COL=COL_16 DIN=NetD1.3.16_2 DOUT=NetD1.3.17_2 ROW=ROW_0
U_matrix/U1: designators end in .18; ports COL=COL_17 DIN=NetD1.3.17_2 DOUT=NetD1.3.18_2 ROW=ROW_0
U_matrix/U1: designators end in .19; ports COL=COL_0 DIN=NetD1.3.19_4 DOUT=NetD1.3.19_2 ROW=ROW_1
U_matrix/U1: designators end in .20; ports COL=COL_1 DIN=NetD1.3.20_4 DOUT=NetD1.3.19_4 ROW=ROW_1
U_matrix/U1: designators end in .21; ports COL=COL_2 DIN=NetD1.3.21_4 DOUT=NetD1.3.20_4 ROW=ROW_1
U_matrix/U1: designators end in .22; ports COL=COL_3 DIN=NetD1.3.22_4 DOUT=NetD1.3.21_4 ROW=ROW_1
U_matrix/U1: designators end in .23; ports COL=COL_4 DIN=NetD1.3.23_4 DOUT=NetD1.3.22_4 ROW=ROW_1
U_matrix/U1: designators end in .24; ports COL=COL_5 DIN=NetD1.3.24_4 DOUT=NetD1.3.23_4 ROW=ROW_1
U_matrix/U1: designators end in .25; ports COL=COL_6 DIN=NetD1.3.25_4 DOUT=NetD1.3.24_4 ROW=ROW_1
U_matrix/U1: designators end in .26; ports COL=COL_7 DIN=NetD1.3.26_4 DOUT=NetD1.3.25_4 ROW=ROW_1
U_matrix/U1: designators end in .27; ports COL=COL_8 DIN=NetD1.3.27_4 DOUT=NetD1.3.26_4 ROW=ROW_1
U_matrix/U1: designators end in .28; ports COL=COL_9 DIN=NetD1.3.28_4 DOUT=NetD1.3.27_4 ROW=ROW_1
U_matrix/U1: designators end in .29; ports COL=COL_10 DIN=NetD1.3.29_4 DOUT=NetD1.3.28_4 ROW=ROW_1
U_matrix/U1: designators end in .30; ports COL=COL_11 DIN=NetD1.3.30_4 DOUT=NetD1.3.29_4 ROW=ROW_1
U_matrix/U1: designators end in .31; ports COL=COL_12 DIN=NetD1.3.31_4 DOUT=NetD1.3.30_4 ROW=ROW_1
U_matrix/U1: designators end in .32; ports COL=COL_13 DIN=NetD1.3.32_4 DOUT=NetD1.3.31_4 ROW=ROW_1
U_matrix/U1: designators end in .33; ports COL=COL_0 DIN=NetD1.3.19_2 DOUT=NetD1.3.33_2 ROW=ROW_2
U_matrix/U1: designators end in .34; ports COL=COL_1 DIN=NetD1.3.33_2 DOUT=NetD1.3.34_2 ROW=ROW_2
U_matrix/U1: designators end in .35; ports COL=COL_2 DIN=NetD1.3.34_2 DOUT=NetD1.3.35_2 ROW=ROW_2
U_matrix/U1: designators end in .36; ports COL=COL_3 DIN=NetD1.3.35_2 DOUT=NetD1.3.36_2 ROW=ROW_2
U_matrix/U1: designators end in .37; ports COL=COL_4 DIN=NetD1.3.36_2 DOUT=NetD1.3.37_2 ROW=ROW_2
U_matrix/U1: designators end in .38; ports COL=COL_5 DIN=NetD1.3.37_2 DOUT=NetD1.3.38_2 ROW=ROW_2
U_matrix/U1: designators end in .39; ports COL=COL_6 DIN=NetD1.3.38_2 DOUT=NetD1.3.39_2 ROW=ROW_2
U_matrix/U1: designators end in .40; ports COL=COL_7 DIN=NetD1.3.39_2 DOUT=NetD1.3.40_2 ROW=ROW_2
U_matrix/U1: designators end in .41; ports COL=COL_8 DIN=NetD1.3.40_2 DOUT=NetD1.3.41_2 ROW=ROW_2
U_matrix/U1: designators end in .42; ports COL=COL_9 DIN=NetD1.3.41_2 DOUT=NetD1.3.42_2 ROW=ROW_2
U_matrix/U1: designators end in .43; ports COL=COL_10 DIN=NetD1.3.42_2 DOUT=NetD1.3.43_2 ROW=ROW_2
U_matrix/U1: designators end in .44; ports COL=COL_11 DIN=NetD1.3.43_2 DOUT=NetD1.3.44_2 ROW=ROW_2
U_matrix/U1: designators end in .45; ports COL=COL_13 DIN=NetD1.3.44_2 DOUT=NetD1.3.45_2 ROW=ROW_2
U_matrix/U1: designators end in .46; ports COL=COL_0 DIN=NetD1.3.46_4 DOUT=NetD1.3.46_2 ROW=ROW_3
U_matrix/U1: designators end in .47; ports COL=COL_2 DIN=NetD1.3.47_4 DOUT=NetD1.3.46_4 ROW=ROW_3
U_matrix/U1: designators end in .48; ports COL=COL_3 DIN=NetD1.3.48_4 DOUT=NetD1.3.47_4 ROW=ROW_3
U_matrix/U1: designators end in .49; ports COL=COL_4 DIN=NetD1.3.49_4 DOUT=NetD1.3.48_4 ROW=ROW_3
U_matrix/U1: designators end in .50; ports COL=COL_5 DIN=NetD1.3.50_4 DOUT=NetD1.3.49_4 ROW=ROW_3
U_matrix/U1: designators end in .51; ports COL=COL_6 DIN=NetD1.3.51_4 DOUT=NetD1.3.50_4 ROW=ROW_3
U_matrix/U1: designators end in .52; ports COL=COL_7 DIN=NetD1.3.52_4 DOUT=NetD1.3.51_4 ROW=ROW_3
U_matrix/U1: designators end in .53; ports COL=COL_8 DIN=NetD1.3.53_4 DOUT=NetD1.3.52_4 ROW=ROW_3
U_matrix/U1: designators end in .54; ports COL=COL_9 DIN=NetD1.3.54_4 DOUT=NetD1.3.53_4 ROW=ROW_3
U_matrix/U1: designators end in .55; ports COL=COL_10 DIN=NetD1.3.55_4 DOUT=NetD1.3.54_4 ROW=ROW_3
U_matrix/U1: designators end in .56; ports COL=COL_11 DIN=NetD1.3.56_4 DOUT=NetD1.3.55_4 ROW=ROW_3
U_matrix/U1: designators end in .57; ports COL=COL_12 DIN=NetD1.3.57_4 DOUT=NetD1.3.56_4 ROW=ROW_3
U_matrix/U1: designators end in .58; ports COL=COL_0 DIN=NetD1.3.46_2 DOUT=NetD1.3.58_2 ROW=ROW_4
U_matrix/U1: designators end in .59; ports COL=COL_1 DIN=NetD1.3.58_2 DOUT=NetD1.3.59_2 ROW=ROW_4
U_matrix/U1: designators end in .60; ports COL=COL_2 DIN=NetD1.3.59_2 DOUT=NetD1.3.60_2 ROW=ROW_4
U_matrix/U1: designators end in .61; ports COL=COL_3 DIN=NetD1.3.60_2 DOUT=NetD1.3.61_2 ROW=ROW_4
U_matrix/U1: designators end in .62; ports COL=COL_4 DIN=NetD1.3.61_2 DOUT=NetD1.3.62_2 ROW=ROW_4
U_matrix/U1: designators end in .63; ports COL=COL_5 DIN=NetD1.3.62_2 DOUT=NetD1.3.63_2 ROW=ROW_4
U_matrix/U1: designators end in .64; ports COL=COL_6 DIN=NetD1.3.63_2 DOUT=NetD1.3.64_2 ROW=ROW_4
U_matrix/U1: designators end in .65; ports COL=COL_8 DIN=NetD1.3.64_2 DOUT=NetD1.3.65_2 ROW=ROW_4
U_matrix/U1: designators end in .66; ports COL=COL_9 DIN=NetD1.3.65_2 DOUT=NetD1.3.66_2 ROW=ROW_4
U_matrix/U1: designators end in .67; ports COL=COL_10 DIN=NetD1.3.66_2 DOUT=NetD1.3.67_2 ROW=ROW_4
U_matrix/U1: designators end in .68; ports COL=COL_11 DIN=NetD1.3.67_2 DOUT=NetD1.3.68_2 ROW=ROW_4
U_matrix/U1: designators end in .69; ports COL=COL_12 DIN=NetD1.3.68_2 DOUT=NetD1.3.69_2 ROW=ROW_4
U_matrix/U1: designators end in .70; ports COL=COL_13 DIN=NetD1.3.69_2 DOUT=NetD1.3.70_2 ROW=ROW_4
U_matrix/U1: designators end in .71; ports COL=COL_14 DIN=NetD1.3.70_2 DOUT=NetD1.3.71_2 ROW=ROW_4
U_matrix/U1: designators end in .72; ports COL=COL_13 DIN=NetD1.3.72_4 DOUT=NetD1.3.57_4 ROW=ROW_3
U_matrix/U1: designators end in .73; ports COL=COL_14 DIN=NetD1.3.73_4 DOUT=NetD1.3.32_4 ROW=ROW_1
U_matrix/U1: designators end in .74; ports COL=COL_15 DIN=NetD1.3.74_4 DOUT=NetD1.3.73_4 ROW=ROW_1
U_matrix/U1: designators end in .75; ports COL=COL_16 DIN=NetD1.3.18_2 DOUT=NetD1.3.74_4 ROW=ROW_1
U_matrix/U1: designators end in .76; ports COL=COL_14 DIN=NetD1.3.45_2 DOUT=NetD1.3.76_2 ROW=ROW_2
U_matrix/U1: designators end in .77; ports COL=COL_15 DIN=NetD1.3.76_2 DOUT=NetD1.3.77_2 ROW=ROW_2
U_matrix/U1: designators end in .78; ports COL=COL_16 DIN=NetD1.3.77_2 DOUT=NetD1.3.78_2 ROW=ROW_2
U_matrix/U1: designators end in .79; ports COL=COL_17 DIN=NetD1.3.78_2 DOUT=NetD1.3.79_2 ROW=ROW_2
U_matrix/U1: designators end in .80; ports COL=COL_14 DIN=NetD1.3.80_4 DOUT=NetD1.3.72_4 ROW=ROW_3
U_matrix/U1: designators end in .81; ports COL=COL_15 DIN=NetD1.3.81_4 DOUT=NetD1.3.80_4 ROW=ROW_3
U_matrix/U1: designators end in .82; ports COL=COL_16 DIN=NetD1.3.79_2 DOUT=NetD1.3.81_4 ROW=ROW_3
U_matrix/U1: designators end in .83; ports COL=COL_15 DIN=NetD1.3.71_2 DOUT=NetD1.3.83_2 ROW=ROW_4
U_matrix/U1: designators end in .84; ports COL=COL_16 DIN=NetD1.3.83_2 DOUT=NetD1.3.84_2 ROW=ROW_4
U_matrix/U1: designators end in .85; ports COL=COL_17 DIN=NetD1.3.84_2 DOUT=NetD1.3.85_2 ROW=ROW_4

### Notes on the sheet
- (near S1.3) @ 3.3V: 330kohm max, 330 ohm min
- (near S1.3) 10uA minimum, 10mA maximum
- 2V minimum, 12V maximum
- 800KHz data rate; not sure about LED PWM

### Library data of the parts
C1.3 = CAPACITOR NON_POL: Value: 100n; Supplier 1: Digi-Key
D1.3 = BL-HRGB32M-TRB: Supplier 1: Digi-Key
D2.3 = DIODE: Supplier 1: Digi-Key
S1.3 = SW-SPST: Single-Pole, Single-Throw Switch; Manufacturer: Kailh; Manufacturer Part Number: PG1350; Supplier: NovelKeys

## Nets that join several sheets
3V3: pokey (8 pins), matrix (26 pins)
5V: pokey (16 pins), matrix (R3.2.2), U_matrix/U1 (C1.3.1.1 D1.3.1.1), U_matrix/U1 (C1.3.2.1 D1.3.2.1), U_matrix/U1 (C1.3.3.1 D1.3.3.1), U_matrix/U1 (C1.3.4.1 D1.3.4.1), U_matrix/U1 (C1.3.5.1 D1.3.5.1), U_matrix/U1 (C1.3.6.1 D1.3.6.1), U_matrix/U1 (C1.3.7.1 D1.3.7.1), U_matrix/U1 (C1.3.8.1 D1.3.8.1), U_matrix/U1 (C1.3.9.1 D1.3.9.1), U_matrix/U1 (C1.3.10.1 D1.3.10.1), U_matrix/U1 (C1.3.11.1 D1.3.11.1), U_matrix/U1 (C1.3.12.1 D1.3.12.1), U_matrix/U1 (C1.3.13.1 D1.3.13.1), U_matrix/U1 (C1.3.14.1 D1.3.14.1), U_matrix/U1 (C1.3.15.1 D1.3.15.1), U_matrix/U1 (C1.3.16.1 D1.3.16.1), U_matrix/U1 (C1.3.17.1 D1.3.17.1), U_matrix/U1 (C1.3.18.1 D1.3.18.1), U_matrix/U1 (C1.3.19.1 D1.3.19.1), U_matrix/U1 (C1.3.20.1 D1.3.20.1), U_matrix/U1 (C1.3.21.1 D1.3.21.1), U_matrix/U1 (C1.3.22.1 D1.3.22.1), U_matrix/U1 (C1.3.23.1 D1.3.23.1), U_matrix/U1 (C1.3.24.1 D1.3.24.1), U_matrix/U1 (C1.3.25.1 D1.3.25.1), U_matrix/U1 (C1.3.26.1 D1.3.26.1), U_matrix/U1 (C1.3.27.1 D1.3.27.1), U_matrix/U1 (C1.3.28.1 D1.3.28.1), U_matrix/U1 (C1.3.29.1 D1.3.29.1), U_matrix/U1 (C1.3.30.1 D1.3.30.1), U_matrix/U1 (C1.3.31.1 D1.3.31.1), U_matrix/U1 (C1.3.32.1 D1.3.32.1), U_matrix/U1 (C1.3.33.1 D1.3.33.1), U_matrix/U1 (C1.3.34.1 D1.3.34.1), U_matrix/U1 (C1.3.35.1 D1.3.35.1), U_matrix/U1 (C1.3.36.1 D1.3.36.1), U_matrix/U1 (C1.3.37.1 D1.3.37.1), U_matrix/U1 (C1.3.38.1 D1.3.38.1), U_matrix/U1 (C1.3.39.1 D1.3.39.1), U_matrix/U1 (C1.3.40.1 D1.3.40.1), U_matrix/U1 (C1.3.41.1 D1.3.41.1), U_matrix/U1 (C1.3.42.1 D1.3.42.1), U_matrix/U1 (C1.3.43.1 D1.3.43.1), U_matrix/U1 (C1.3.44.1 D1.3.44.1), U_matrix/U1 (C1.3.45.1 D1.3.45.1), U_matrix/U1 (C1.3.46.1 D1.3.46.1), U_matrix/U1 (C1.3.47.1 D1.3.47.1), U_matrix/U1 (C1.3.48.1 D1.3.48.1), U_matrix/U1 (C1.3.49.1 D1.3.49.1), U_matrix/U1 (C1.3.50.1 D1.3.50.1), U_matrix/U1 (C1.3.51.1 D1.3.51.1), U_matrix/U1 (C1.3.52.1 D1.3.52.1), U_matrix/U1 (C1.3.53.1 D1.3.53.1), U_matrix/U1 (C1.3.54.1 D1.3.54.1), U_matrix/U1 (C1.3.55.1 D1.3.55.1), U_matrix/U1 (C1.3.56.1 D1.3.56.1), U_matrix/U1 (C1.3.57.1 D1.3.57.1), U_matrix/U1 (C1.3.58.1 D1.3.58.1), U_matrix/U1 (C1.3.59.1 D1.3.59.1), U_matrix/U1 (C1.3.60.1 D1.3.60.1), U_matrix/U1 (C1.3.61.1 D1.3.61.1), U_matrix/U1 (C1.3.62.1 D1.3.62.1), U_matrix/U1 (C1.3.63.1 D1.3.63.1), U_matrix/U1 (C1.3.64.1 D1.3.64.1), U_matrix/U1 (C1.3.65.1 D1.3.65.1), U_matrix/U1 (C1.3.66.1 D1.3.66.1), U_matrix/U1 (C1.3.67.1 D1.3.67.1), U_matrix/U1 (C1.3.68.1 D1.3.68.1), U_matrix/U1 (C1.3.69.1 D1.3.69.1), U_matrix/U1 (C1.3.70.1 D1.3.70.1), U_matrix/U1 (C1.3.71.1 D1.3.71.1), U_matrix/U1 (C1.3.72.1 D1.3.72.1), U_matrix/U1 (C1.3.73.1 D1.3.73.1), U_matrix/U1 (C1.3.74.1 D1.3.74.1), U_matrix/U1 (C1.3.75.1 D1.3.75.1), U_matrix/U1 (C1.3.76.1 D1.3.76.1), U_matrix/U1 (C1.3.77.1 D1.3.77.1), U_matrix/U1 (C1.3.78.1 D1.3.78.1), U_matrix/U1 (C1.3.79.1 D1.3.79.1), U_matrix/U1 (C1.3.80.1 D1.3.80.1), U_matrix/U1 (C1.3.81.1 D1.3.81.1), U_matrix/U1 (C1.3.82.1 D1.3.82.1), U_matrix/U1 (C1.3.83.1 D1.3.83.1), U_matrix/U1 (C1.3.84.1 D1.3.84.1), U_matrix/U1 (C1.3.85.1 D1.3.85.1)
GND: pokey (23 pins), matrix (34 pins), U_matrix/U1 (C1.3.1.2 D1.3.1.3), U_matrix/U1 (C1.3.2.2 D1.3.2.3), U_matrix/U1 (C1.3.3.2 D1.3.3.3), U_matrix/U1 (C1.3.4.2 D1.3.4.3), U_matrix/U1 (C1.3.5.2 D1.3.5.3), U_matrix/U1 (C1.3.6.2 D1.3.6.3), U_matrix/U1 (C1.3.7.2 D1.3.7.3), U_matrix/U1 (C1.3.8.2 D1.3.8.3), U_matrix/U1 (C1.3.9.2 D1.3.9.3), U_matrix/U1 (C1.3.10.2 D1.3.10.3), U_matrix/U1 (C1.3.11.2 D1.3.11.3), U_matrix/U1 (C1.3.12.2 D1.3.12.3), U_matrix/U1 (C1.3.13.2 D1.3.13.3), U_matrix/U1 (C1.3.14.2 D1.3.14.3), U_matrix/U1 (C1.3.15.2 D1.3.15.3), U_matrix/U1 (C1.3.16.2 D1.3.16.3), U_matrix/U1 (C1.3.17.2 D1.3.17.3), U_matrix/U1 (C1.3.18.2 D1.3.18.3), U_matrix/U1 (C1.3.19.2 D1.3.19.3), U_matrix/U1 (C1.3.20.2 D1.3.20.3), U_matrix/U1 (C1.3.21.2 D1.3.21.3), U_matrix/U1 (C1.3.22.2 D1.3.22.3), U_matrix/U1 (C1.3.23.2 D1.3.23.3), U_matrix/U1 (C1.3.24.2 D1.3.24.3), U_matrix/U1 (C1.3.25.2 D1.3.25.3), U_matrix/U1 (C1.3.26.2 D1.3.26.3), U_matrix/U1 (C1.3.27.2 D1.3.27.3), U_matrix/U1 (C1.3.28.2 D1.3.28.3), U_matrix/U1 (C1.3.29.2 D1.3.29.3), U_matrix/U1 (C1.3.30.2 D1.3.30.3), U_matrix/U1 (C1.3.31.2 D1.3.31.3), U_matrix/U1 (C1.3.32.2 D1.3.32.3), U_matrix/U1 (C1.3.33.2 D1.3.33.3), U_matrix/U1 (C1.3.34.2 D1.3.34.3), U_matrix/U1 (C1.3.35.2 D1.3.35.3), U_matrix/U1 (C1.3.36.2 D1.3.36.3), U_matrix/U1 (C1.3.37.2 D1.3.37.3), U_matrix/U1 (C1.3.38.2 D1.3.38.3), U_matrix/U1 (C1.3.39.2 D1.3.39.3), U_matrix/U1 (C1.3.40.2 D1.3.40.3), U_matrix/U1 (C1.3.41.2 D1.3.41.3), U_matrix/U1 (C1.3.42.2 D1.3.42.3), U_matrix/U1 (C1.3.43.2 D1.3.43.3), U_matrix/U1 (C1.3.44.2 D1.3.44.3), U_matrix/U1 (C1.3.45.2 D1.3.45.3), U_matrix/U1 (C1.3.46.2 D1.3.46.3), U_matrix/U1 (C1.3.47.2 D1.3.47.3), U_matrix/U1 (C1.3.48.2 D1.3.48.3), U_matrix/U1 (C1.3.49.2 D1.3.49.3), U_matrix/U1 (C1.3.50.2 D1.3.50.3), U_matrix/U1 (C1.3.51.2 D1.3.51.3), U_matrix/U1 (C1.3.52.2 D1.3.52.3), U_matrix/U1 (C1.3.53.2 D1.3.53.3), U_matrix/U1 (C1.3.54.2 D1.3.54.3), U_matrix/U1 (C1.3.55.2 D1.3.55.3), U_matrix/U1 (C1.3.56.2 D1.3.56.3), U_matrix/U1 (C1.3.57.2 D1.3.57.3), U_matrix/U1 (C1.3.58.2 D1.3.58.3), U_matrix/U1 (C1.3.59.2 D1.3.59.3), U_matrix/U1 (C1.3.60.2 D1.3.60.3), U_matrix/U1 (C1.3.61.2 D1.3.61.3), U_matrix/U1 (C1.3.62.2 D1.3.62.3), U_matrix/U1 (C1.3.63.2 D1.3.63.3), U_matrix/U1 (C1.3.64.2 D1.3.64.3), U_matrix/U1 (C1.3.65.2 D1.3.65.3), U_matrix/U1 (C1.3.66.2 D1.3.66.3), U_matrix/U1 (C1.3.67.2 D1.3.67.3), U_matrix/U1 (C1.3.68.2 D1.3.68.3), U_matrix/U1 (C1.3.69.2 D1.3.69.3), U_matrix/U1 (C1.3.70.2 D1.3.70.3), U_matrix/U1 (C1.3.71.2 D1.3.71.3), U_matrix/U1 (C1.3.72.2 D1.3.72.3), U_matrix/U1 (C1.3.73.2 D1.3.73.3), U_matrix/U1 (C1.3.74.2 D1.3.74.3), U_matrix/U1 (C1.3.75.2 D1.3.75.3), U_matrix/U1 (C1.3.76.2 D1.3.76.3), U_matrix/U1 (C1.3.77.2 D1.3.77.3), U_matrix/U1 (C1.3.78.2 D1.3.78.3), U_matrix/U1 (C1.3.79.2 D1.3.79.3), U_matrix/U1 (C1.3.80.2 D1.3.80.3), U_matrix/U1 (C1.3.81.2 D1.3.81.3), U_matrix/U1 (C1.3.82.2 D1.3.82.3), U_matrix/U1 (C1.3.83.2 D1.3.83.3), U_matrix/U1 (C1.3.84.2 D1.3.84.3), U_matrix/U1 (C1.3.85.2 D1.3.85.3)
COL_0: matrix (U1.2.3), U_matrix/U1 (S1.3.1.1), U_matrix/U1 (S1.3.19.1), U_matrix/U1 (S1.3.33.1), U_matrix/U1 (S1.3.46.1), U_matrix/U1 (S1.3.58.1)
COL_1: matrix (U1.2.4), U_matrix/U1 (S1.3.2.1), U_matrix/U1 (S1.3.20.1), U_matrix/U1 (S1.3.34.1), U_matrix/U1 (S1.3.59.1)
COL_2: matrix (U1.2.5), U_matrix/U1 (S1.3.3.1), U_matrix/U1 (S1.3.21.1), U_matrix/U1 (S1.3.35.1), U_matrix/U1 (S1.3.47.1), U_matrix/U1 (S1.3.60.1)
COL_3: matrix (U1.2.6), U_matrix/U1 (S1.3.4.1), U_matrix/U1 (S1.3.22.1), U_matrix/U1 (S1.3.36.1), U_matrix/U1 (S1.3.48.1), U_matrix/U1 (S1.3.61.1)
COL_4: matrix (U1.2.10), U_matrix/U1 (S1.3.5.1), U_matrix/U1 (S1.3.23.1), U_matrix/U1 (S1.3.37.1), U_matrix/U1 (S1.3.49.1), U_matrix/U1 (S1.3.62.1)
COL_5: matrix (U1.2.11), U_matrix/U1 (S1.3.6.1), U_matrix/U1 (S1.3.24.1), U_matrix/U1 (S1.3.38.1), U_matrix/U1 (S1.3.50.1), U_matrix/U1 (S1.3.63.1)
COL_6: matrix (U1.2.12), U_matrix/U1 (S1.3.7.1), U_matrix/U1 (S1.3.25.1), U_matrix/U1 (S1.3.39.1), U_matrix/U1 (S1.3.51.1), U_matrix/U1 (S1.3.64.1)
COL_7: matrix (U1.2.13 U2.2.2), U_matrix/U1 (S1.3.8.1), U_matrix/U1 (S1.3.26.1), U_matrix/U1 (S1.3.40.1), U_matrix/U1 (S1.3.52.1)
COL_8: matrix (U2.2.3), U_matrix/U1 (S1.3.9.1), U_matrix/U1 (S1.3.27.1), U_matrix/U1 (S1.3.41.1), U_matrix/U1 (S1.3.53.1), U_matrix/U1 (S1.3.65.1)
COL_9: matrix (U2.2.4), U_matrix/U1 (S1.3.10.1), U_matrix/U1 (S1.3.28.1), U_matrix/U1 (S1.3.42.1), U_matrix/U1 (S1.3.54.1), U_matrix/U1 (S1.3.66.1)
COL_10: matrix (U2.2.5), U_matrix/U1 (S1.3.11.1), U_matrix/U1 (S1.3.29.1), U_matrix/U1 (S1.3.43.1), U_matrix/U1 (S1.3.55.1), U_matrix/U1 (S1.3.67.1)
COL_11: matrix (U2.2.6), U_matrix/U1 (S1.3.12.1), U_matrix/U1 (S1.3.30.1), U_matrix/U1 (S1.3.44.1), U_matrix/U1 (S1.3.56.1), U_matrix/U1 (S1.3.68.1)
COL_12: matrix (U2.2.10), U_matrix/U1 (S1.3.13.1), U_matrix/U1 (S1.3.31.1), U_matrix/U1 (S1.3.57.1), U_matrix/U1 (S1.3.69.1)
COL_13: matrix (U2.2.11), U_matrix/U1 (S1.3.14.1), U_matrix/U1 (S1.3.32.1), U_matrix/U1 (S1.3.45.1), U_matrix/U1 (S1.3.70.1), U_matrix/U1 (S1.3.72.1)
COL_14: matrix (U2.2.12), U_matrix/U1 (S1.3.15.1), U_matrix/U1 (S1.3.71.1), U_matrix/U1 (S1.3.73.1), U_matrix/U1 (S1.3.76.1), U_matrix/U1 (S1.3.80.1)
COL_15: matrix (U2.2.13 U3.2.2), U_matrix/U1 (S1.3.16.1), U_matrix/U1 (S1.3.74.1), U_matrix/U1 (S1.3.77.1), U_matrix/U1 (S1.3.81.1), U_matrix/U1 (S1.3.83.1)
COL_16: matrix (U3.2.3), U_matrix/U1 (S1.3.17.1), U_matrix/U1 (S1.3.75.1), U_matrix/U1 (S1.3.78.1), U_matrix/U1 (S1.3.82.1), U_matrix/U1 (S1.3.84.1)
COL_17: matrix (U3.2.4), U_matrix/U1 (S1.3.18.1), U_matrix/U1 (S1.3.79.1), U_matrix/U1 (S1.3.85.1)
NetD1.3.1_2: U_matrix/U1 (D1.3.1.2), U_matrix/U1 (D1.3.2.4)
NetD1.3.1_4: matrix (Q1.2.1 R3.2.1), U_matrix/U1 (D1.3.1.4)
NetD1.3.2_2: U_matrix/U1 (D1.3.2.2), U_matrix/U1 (D1.3.3.4)
NetD1.3.3_2: U_matrix/U1 (D1.3.3.2), U_matrix/U1 (D1.3.4.4)
NetD1.3.4_2: U_matrix/U1 (D1.3.4.2), U_matrix/U1 (D1.3.5.4)
NetD1.3.5_2: U_matrix/U1 (D1.3.5.2), U_matrix/U1 (D1.3.6.4)
NetD1.3.6_2: U_matrix/U1 (D1.3.6.2), U_matrix/U1 (D1.3.7.4)
NetD1.3.7_2: U_matrix/U1 (D1.3.7.2), U_matrix/U1 (D1.3.8.4)
NetD1.3.8_2: U_matrix/U1 (D1.3.8.2), U_matrix/U1 (D1.3.9.4)
NetD1.3.9_2: U_matrix/U1 (D1.3.9.2), U_matrix/U1 (D1.3.10.4)
NetD1.3.10_2: U_matrix/U1 (D1.3.10.2), U_matrix/U1 (D1.3.11.4)
NetD1.3.11_2: U_matrix/U1 (D1.3.11.2), U_matrix/U1 (D1.3.12.4)
NetD1.3.12_2: U_matrix/U1 (D1.3.12.2), U_matrix/U1 (D1.3.13.4)
NetD1.3.13_2: U_matrix/U1 (D1.3.13.2), U_matrix/U1 (D1.3.14.4)
NetD1.3.14_2: U_matrix/U1 (D1.3.14.2), U_matrix/U1 (D1.3.15.4)
NetD1.3.15_2: U_matrix/U1 (D1.3.15.2), U_matrix/U1 (D1.3.16.4)
NetD1.3.16_2: U_matrix/U1 (D1.3.16.2), U_matrix/U1 (D1.3.17.4)
NetD1.3.17_2: U_matrix/U1 (D1.3.17.2), U_matrix/U1 (D1.3.18.4)
NetD1.3.18_2: U_matrix/U1 (D1.3.18.2), U_matrix/U1 (D1.3.75.4)
NetD1.3.19_2: U_matrix/U1 (D1.3.19.2), U_matrix/U1 (D1.3.33.4)
NetD1.3.19_4: U_matrix/U1 (D1.3.19.4), U_matrix/U1 (D1.3.20.2)
NetD1.3.20_4: U_matrix/U1 (D1.3.20.4), U_matrix/U1 (D1.3.21.2)
NetD1.3.21_4: U_matrix/U1 (D1.3.21.4), U_matrix/U1 (D1.3.22.2)
NetD1.3.22_4: U_matrix/U1 (D1.3.22.4), U_matrix/U1 (D1.3.23.2)
NetD1.3.23_4: U_matrix/U1 (D1.3.23.4), U_matrix/U1 (D1.3.24.2)
NetD1.3.24_4: U_matrix/U1 (D1.3.24.4), U_matrix/U1 (D1.3.25.2)
NetD1.3.25_4: U_matrix/U1 (D1.3.25.4), U_matrix/U1 (D1.3.26.2)
NetD1.3.26_4: U_matrix/U1 (D1.3.26.4), U_matrix/U1 (D1.3.27.2)
NetD1.3.27_4: U_matrix/U1 (D1.3.27.4), U_matrix/U1 (D1.3.28.2)
NetD1.3.28_4: U_matrix/U1 (D1.3.28.4), U_matrix/U1 (D1.3.29.2)
NetD1.3.29_4: U_matrix/U1 (D1.3.29.4), U_matrix/U1 (D1.3.30.2)
NetD1.3.30_4: U_matrix/U1 (D1.3.30.4), U_matrix/U1 (D1.3.31.2)
NetD1.3.31_4: U_matrix/U1 (D1.3.31.4), U_matrix/U1 (D1.3.32.2)
NetD1.3.32_4: U_matrix/U1 (D1.3.32.4), U_matrix/U1 (D1.3.73.2)
NetD1.3.33_2: U_matrix/U1 (D1.3.33.2), U_matrix/U1 (D1.3.34.4)
NetD1.3.34_2: U_matrix/U1 (D1.3.34.2), U_matrix/U1 (D1.3.35.4)
NetD1.3.35_2: U_matrix/U1 (D1.3.35.2), U_matrix/U1 (D1.3.36.4)
NetD1.3.36_2: U_matrix/U1 (D1.3.36.2), U_matrix/U1 (D1.3.37.4)
NetD1.3.37_2: U_matrix/U1 (D1.3.37.2), U_matrix/U1 (D1.3.38.4)
NetD1.3.38_2: U_matrix/U1 (D1.3.38.2), U_matrix/U1 (D1.3.39.4)
NetD1.3.39_2: U_matrix/U1 (D1.3.39.2), U_matrix/U1 (D1.3.40.4)
NetD1.3.40_2: U_matrix/U1 (D1.3.40.2), U_matrix/U1 (D1.3.41.4)
NetD1.3.41_2: U_matrix/U1 (D1.3.41.2), U_matrix/U1 (D1.3.42.4)
NetD1.3.42_2: U_matrix/U1 (D1.3.42.2), U_matrix/U1 (D1.3.43.4)
NetD1.3.43_2: U_matrix/U1 (D1.3.43.2), U_matrix/U1 (D1.3.44.4)
NetD1.3.44_2: U_matrix/U1 (D1.3.44.2), U_matrix/U1 (D1.3.45.4)
NetD1.3.45_2: U_matrix/U1 (D1.3.45.2), U_matrix/U1 (D1.3.76.4)
NetD1.3.46_2: U_matrix/U1 (D1.3.46.2), U_matrix/U1 (D1.3.58.4)
NetD1.3.46_4: U_matrix/U1 (D1.3.46.4), U_matrix/U1 (D1.3.47.2)
NetD1.3.47_4: U_matrix/U1 (D1.3.47.4), U_matrix/U1 (D1.3.48.2)
NetD1.3.48_4: U_matrix/U1 (D1.3.48.4), U_matrix/U1 (D1.3.49.2)
NetD1.3.49_4: U_matrix/U1 (D1.3.49.4), U_matrix/U1 (D1.3.50.2)
NetD1.3.50_4: U_matrix/U1 (D1.3.50.4), U_matrix/U1 (D1.3.51.2)
NetD1.3.51_4: U_matrix/U1 (D1.3.51.4), U_matrix/U1 (D1.3.52.2)
NetD1.3.52_4: U_matrix/U1 (D1.3.52.4), U_matrix/U1 (D1.3.53.2)
NetD1.3.53_4: U_matrix/U1 (D1.3.53.4), U_matrix/U1 (D1.3.54.2)
NetD1.3.54_4: U_matrix/U1 (D1.3.54.4), U_matrix/U1 (D1.3.55.2)
NetD1.3.55_4: U_matrix/U1 (D1.3.55.4), U_matrix/U1 (D1.3.56.2)
NetD1.3.56_4: U_matrix/U1 (D1.3.56.4), U_matrix/U1 (D1.3.57.2)
NetD1.3.57_4: U_matrix/U1 (D1.3.57.4), U_matrix/U1 (D1.3.72.2)
NetD1.3.58_2: U_matrix/U1 (D1.3.58.2), U_matrix/U1 (D1.3.59.4)
NetD1.3.59_2: U_matrix/U1 (D1.3.59.2), U_matrix/U1 (D1.3.60.4)
NetD1.3.60_2: U_matrix/U1 (D1.3.60.2), U_matrix/U1 (D1.3.61.4)
NetD1.3.61_2: U_matrix/U1 (D1.3.61.2), U_matrix/U1 (D1.3.62.4)
NetD1.3.62_2: U_matrix/U1 (D1.3.62.2), U_matrix/U1 (D1.3.63.4)
NetD1.3.63_2: U_matrix/U1 (D1.3.63.2), U_matrix/U1 (D1.3.64.4)
NetD1.3.64_2: U_matrix/U1 (D1.3.64.2), U_matrix/U1 (D1.3.65.4)
NetD1.3.65_2: U_matrix/U1 (D1.3.65.2), U_matrix/U1 (D1.3.66.4)
NetD1.3.66_2: U_matrix/U1 (D1.3.66.2), U_matrix/U1 (D1.3.67.4)
NetD1.3.67_2: U_matrix/U1 (D1.3.67.2), U_matrix/U1 (D1.3.68.4)
NetD1.3.68_2: U_matrix/U1 (D1.3.68.2), U_matrix/U1 (D1.3.69.4)
NetD1.3.69_2: U_matrix/U1 (D1.3.69.2), U_matrix/U1 (D1.3.70.4)
NetD1.3.70_2: U_matrix/U1 (D1.3.70.2), U_matrix/U1 (D1.3.71.4)
NetD1.3.71_2: U_matrix/U1 (D1.3.71.2), U_matrix/U1 (D1.3.83.4)
NetD1.3.72_4: U_matrix/U1 (D1.3.72.4), U_matrix/U1 (D1.3.80.2)
NetD1.3.73_4: U_matrix/U1 (D1.3.73.4), U_matrix/U1 (D1.3.74.2)
NetD1.3.74_4: U_matrix/U1 (D1.3.74.4), U_matrix/U1 (D1.3.75.2)
NetD1.3.76_2: U_matrix/U1 (D1.3.76.2), U_matrix/U1 (D1.3.77.4)
NetD1.3.77_2: U_matrix/U1 (D1.3.77.2), U_matrix/U1 (D1.3.78.4)
NetD1.3.78_2: U_matrix/U1 (D1.3.78.2), U_matrix/U1 (D1.3.79.4)
NetD1.3.79_2: U_matrix/U1 (D1.3.79.2), U_matrix/U1 (D1.3.82.4)
NetD1.3.80_4: U_matrix/U1 (D1.3.80.4), U_matrix/U1 (D1.3.81.2)
NetD1.3.81_4: U_matrix/U1 (D1.3.81.4), U_matrix/U1 (D1.3.82.2)
NetD1.3.83_2: U_matrix/U1 (D1.3.83.2), U_matrix/U1 (D1.3.84.4)
NetD1.3.84_2: U_matrix/U1 (D1.3.84.2), U_matrix/U1 (D1.3.85.4)
NetD1.3.85_2: matrix (R11.2.2), U_matrix/U1 (D1.3.85.2)
NetQ1.2_3: pokey (U1.1.12), matrix (Q1.2.3 R4.2.1)
NetU1.1_24: pokey (U1.1.24), matrix (U4.2.1 U4.2.9 U5.2.10)
NetU1.1_25: pokey (U1.1.25), matrix (U6.2.2)
NetU1.1_28: pokey (U1.1.28), matrix (U6.2.9)
ROW_0: matrix (R6.2.2 U6.2.11), U_matrix/U1 (D2.3.1.K), U_matrix/U1 (D2.3.2.K), U_matrix/U1 (D2.3.3.K), U_matrix/U1 (D2.3.4.K), U_matrix/U1 (D2.3.5.K), U_matrix/U1 (D2.3.6.K), U_matrix/U1 (D2.3.7.K), U_matrix/U1 (D2.3.8.K), U_matrix/U1 (D2.3.9.K), U_matrix/U1 (D2.3.10.K), U_matrix/U1 (D2.3.11.K), U_matrix/U1 (D2.3.12.K), U_matrix/U1 (D2.3.13.K), U_matrix/U1 (D2.3.14.K), U_matrix/U1 (D2.3.15.K), U_matrix/U1 (D2.3.16.K), U_matrix/U1 (D2.3.17.K), U_matrix/U1 (D2.3.18.K)
ROW_1: matrix (R8.2.2 U6.2.12), U_matrix/U1 (D2.3.19.K), U_matrix/U1 (D2.3.20.K), U_matrix/U1 (D2.3.21.K), U_matrix/U1 (D2.3.22.K), U_matrix/U1 (D2.3.23.K), U_matrix/U1 (D2.3.24.K), U_matrix/U1 (D2.3.25.K), U_matrix/U1 (D2.3.26.K), U_matrix/U1 (D2.3.27.K), U_matrix/U1 (D2.3.28.K), U_matrix/U1 (D2.3.29.K), U_matrix/U1 (D2.3.30.K), U_matrix/U1 (D2.3.31.K), U_matrix/U1 (D2.3.32.K), U_matrix/U1 (D2.3.73.K), U_matrix/U1 (D2.3.74.K), U_matrix/U1 (D2.3.75.K)
ROW_2: matrix (R9.2.2 U6.2.13), U_matrix/U1 (D2.3.33.K), U_matrix/U1 (D2.3.34.K), U_matrix/U1 (D2.3.35.K), U_matrix/U1 (D2.3.36.K), U_matrix/U1 (D2.3.37.K), U_matrix/U1 (D2.3.38.K), U_matrix/U1 (D2.3.39.K), U_matrix/U1 (D2.3.40.K), U_matrix/U1 (D2.3.41.K), U_matrix/U1 (D2.3.42.K), U_matrix/U1 (D2.3.43.K), U_matrix/U1 (D2.3.44.K), U_matrix/U1 (D2.3.45.K), U_matrix/U1 (D2.3.76.K), U_matrix/U1 (D2.3.77.K), U_matrix/U1 (D2.3.78.K), U_matrix/U1 (D2.3.79.K)
ROW_3: matrix (R10.2.2 U6.2.14), U_matrix/U1 (D2.3.46.K), U_matrix/U1 (D2.3.47.K), U_matrix/U1 (D2.3.48.K), U_matrix/U1 (D2.3.49.K), U_matrix/U1 (D2.3.50.K), U_matrix/U1 (D2.3.51.K), U_matrix/U1 (D2.3.52.K), U_matrix/U1 (D2.3.53.K), U_matrix/U1 (D2.3.54.K), U_matrix/U1 (D2.3.55.K), U_matrix/U1 (D2.3.56.K), U_matrix/U1 (D2.3.57.K), U_matrix/U1 (D2.3.72.K), U_matrix/U1 (D2.3.80.K), U_matrix/U1 (D2.3.81.K), U_matrix/U1 (D2.3.82.K)
ROW_4: matrix (R12.2.2 U6.2.3), U_matrix/U1 (D2.3.58.K), U_matrix/U1 (D2.3.59.K), U_matrix/U1 (D2.3.60.K), U_matrix/U1 (D2.3.61.K), U_matrix/U1 (D2.3.62.K), U_matrix/U1 (D2.3.63.K), U_matrix/U1 (D2.3.64.K), U_matrix/U1 (D2.3.65.K), U_matrix/U1 (D2.3.66.K), U_matrix/U1 (D2.3.67.K), U_matrix/U1 (D2.3.68.K), U_matrix/U1 (D2.3.69.K), U_matrix/U1 (D2.3.70.K), U_matrix/U1 (D2.3.71.K), U_matrix/U1 (D2.3.83.K), U_matrix/U1 (D2.3.84.K), U_matrix/U1 (D2.3.85.K)